# EAGLE schematic RBCX (EAGLE 9.6.2), part 2 of 3
## Sheet 4 of 8: User interface
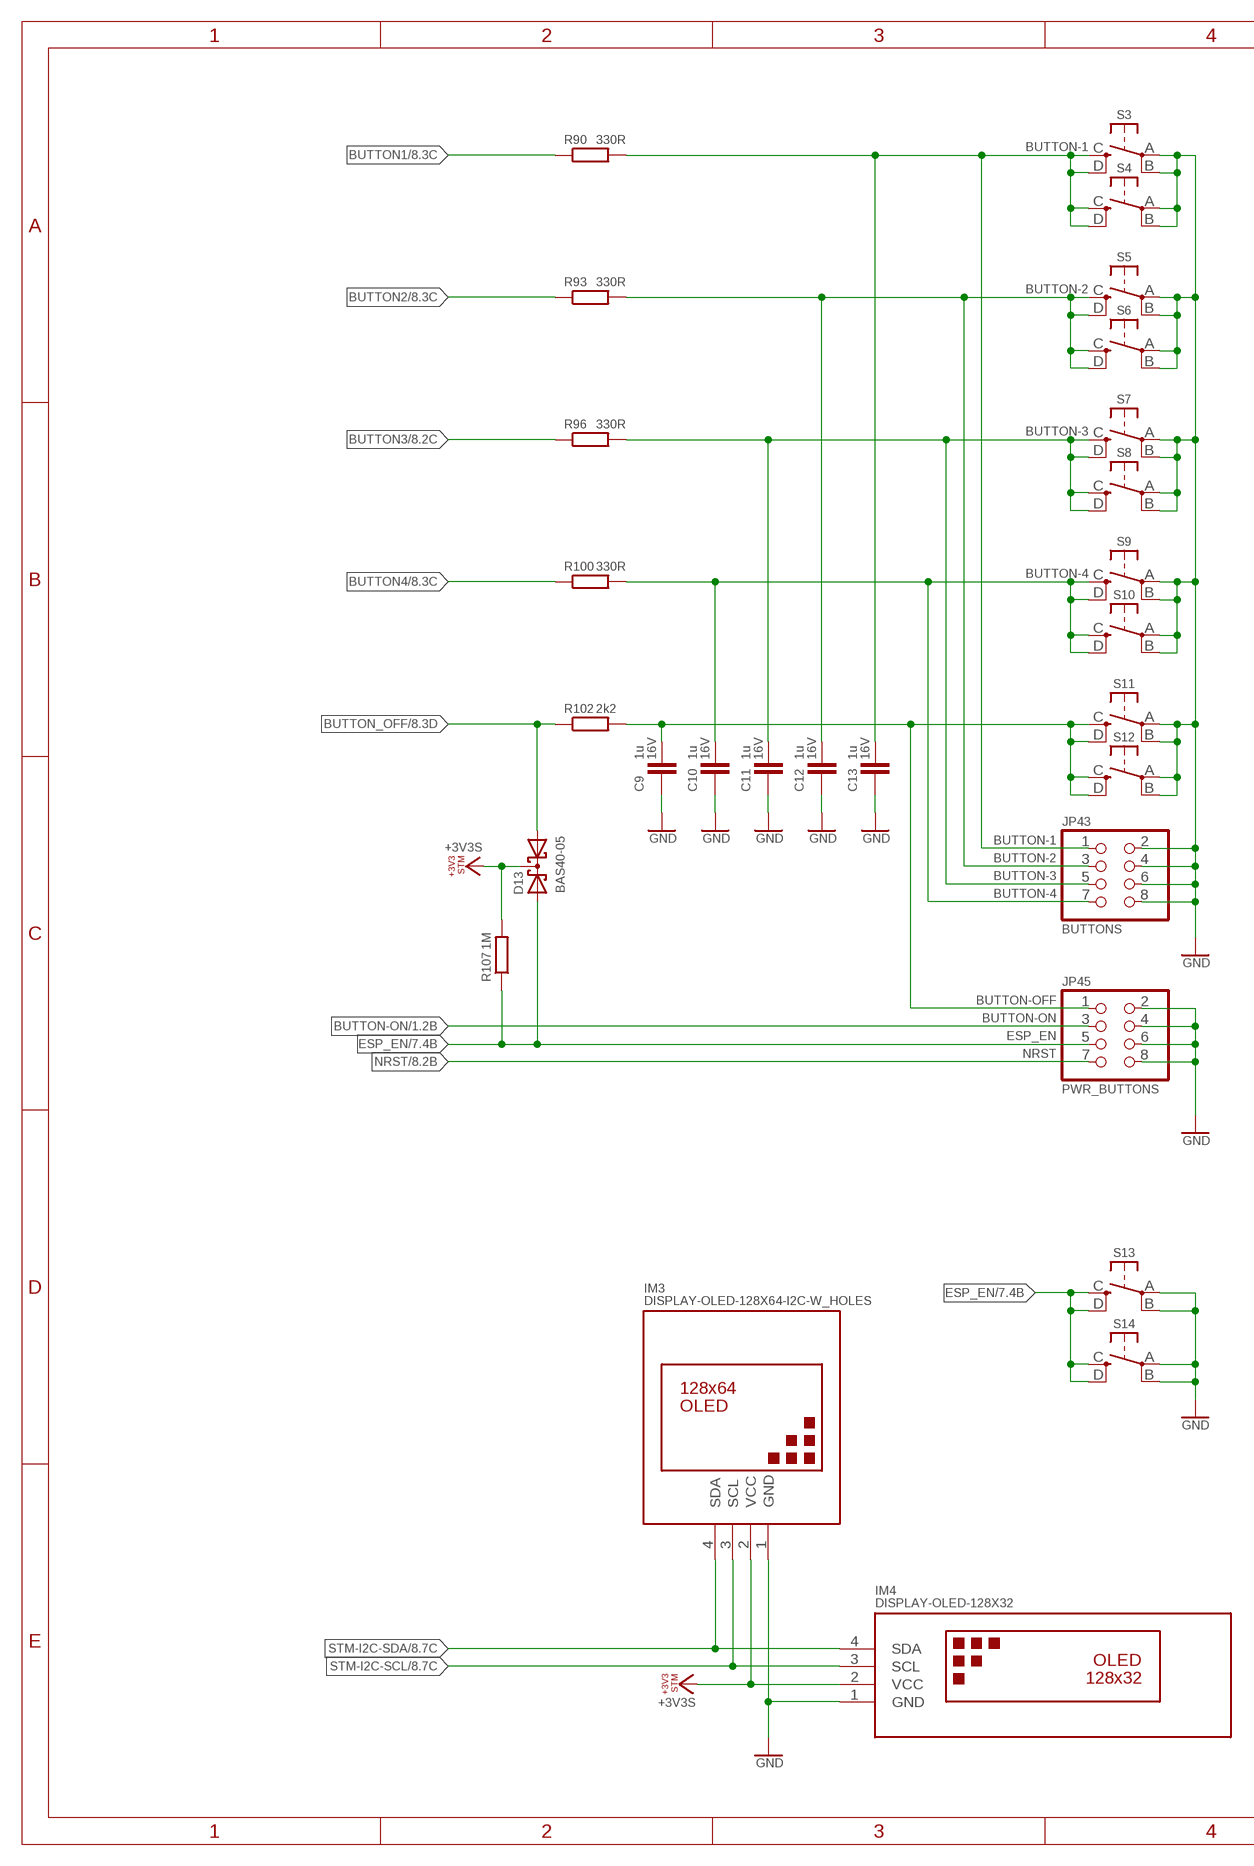
[diagram p6: schematic, sheet 4, part 1 of 2]
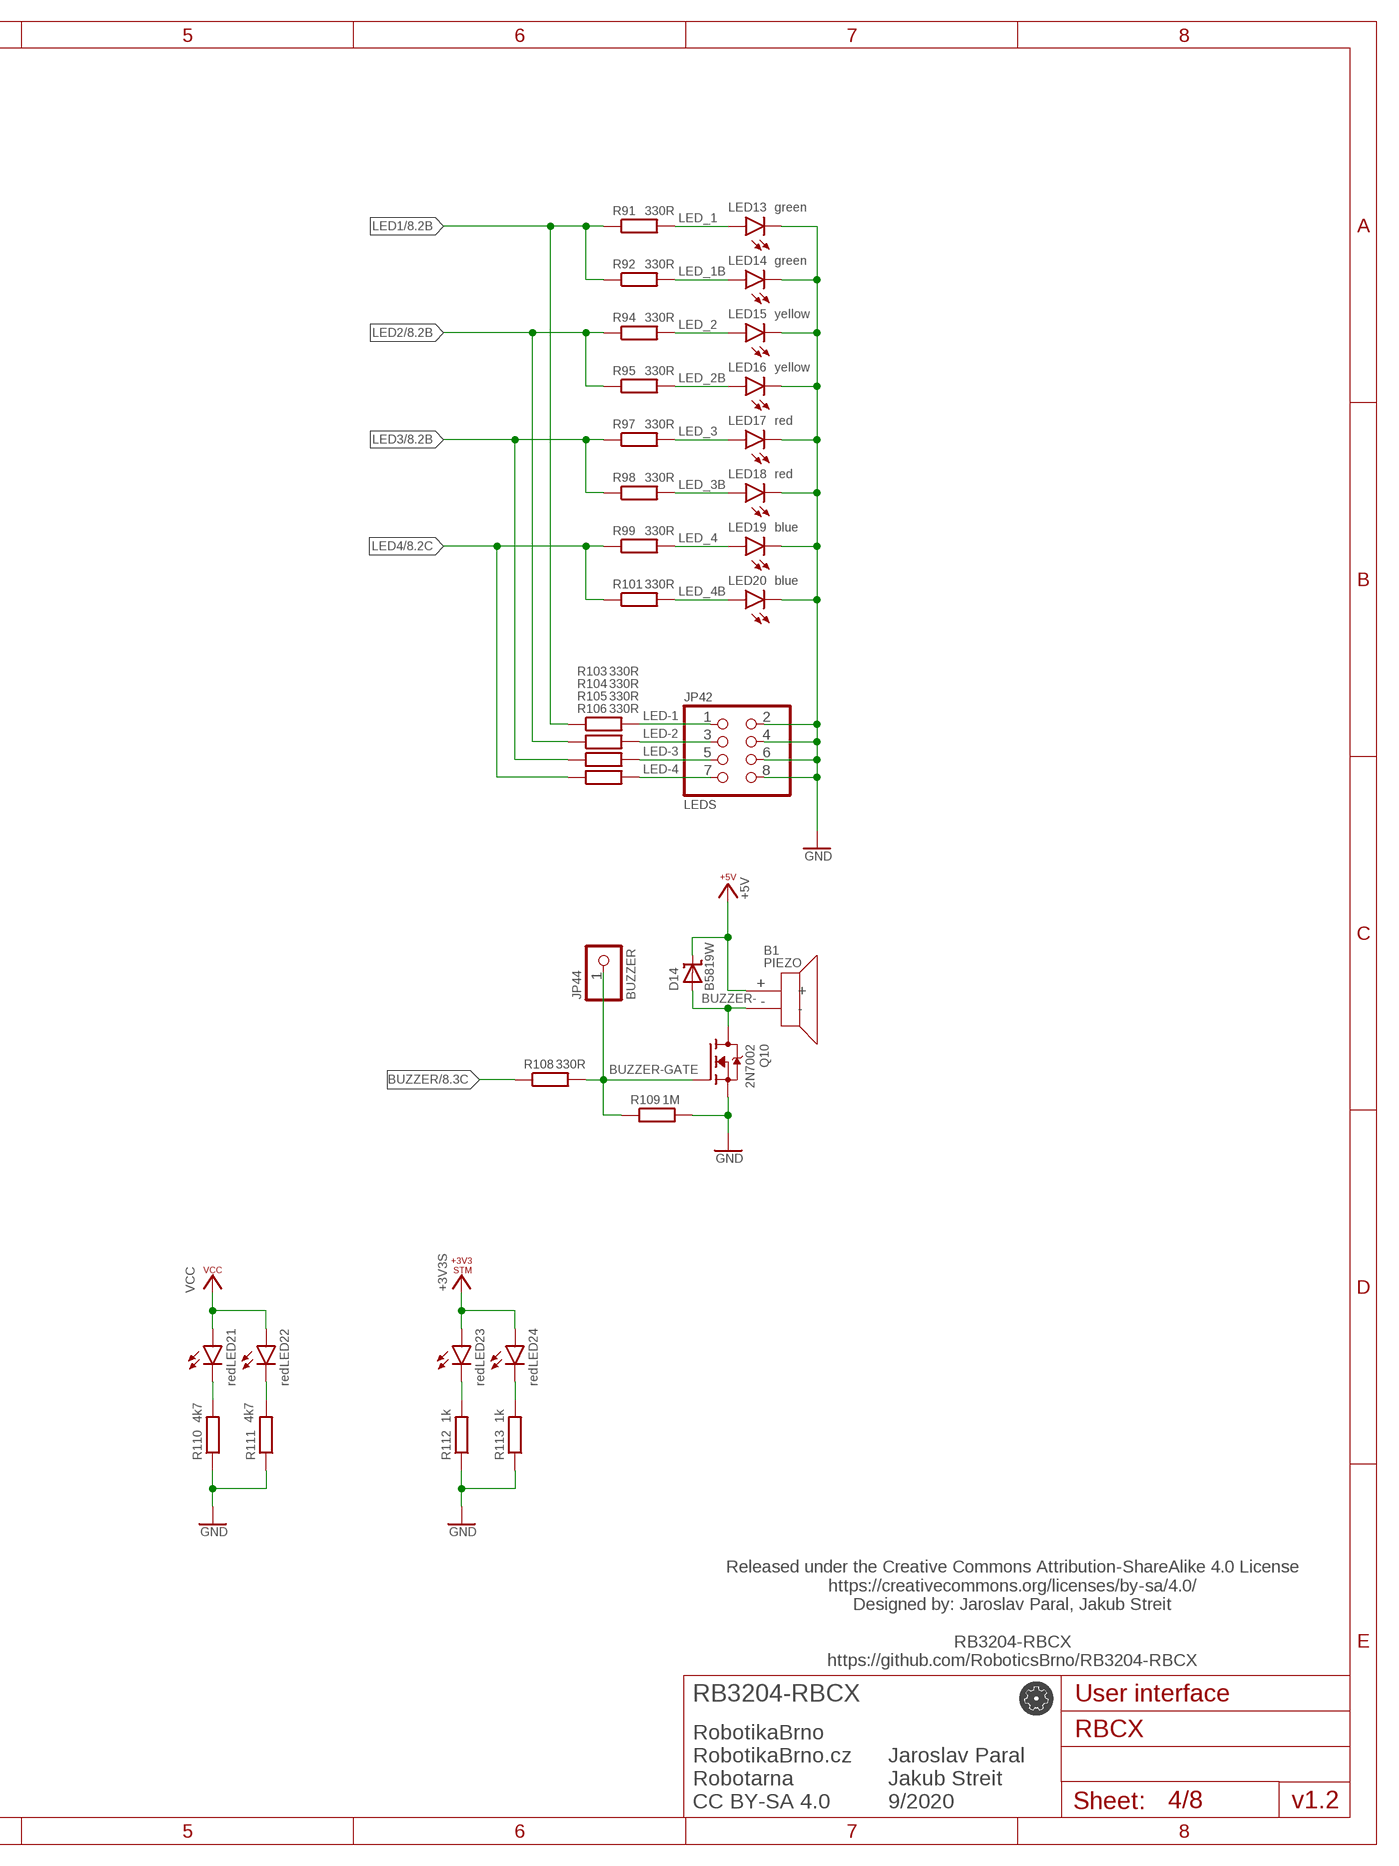
[diagram p7: schematic, sheet 4, part 2 of 2]

### Parts
B1  PIEZO  [PIEZO]  (not fitted in variant TOP_SMD_FULL)  (not fitted in variant TOP_SMD_WITHOUT_MPU)  (not fitted in variant TOP_SMD_WITHOUT_MOTOR_CURRENT)  (not fitted in variant TOP_SMD_WITHOUT_SERVO_CURRENT)  (not fitted in variant TOP_SMD_WITHOUT_CURRENT)  (not fitted in variant TOP_SMD_MINIMAL)
C9  1u  C-EUC0402  [C0402]
C10  1u  C-EUC0402  [C0402]
C11  1u  C-EUC0402  [C0402]
C12  1u  C-EUC0402  [C0402]
C13  1u  C-EUC0402  [C0402]
D13  BAS40-05  [SOT23]
D14  B5819W  SHOTTKY-SOD123  [SOD123]
IM3  DISPLAY-OLED-128X64-I2C-W_HOLES  [DISPLAY-OLED-128X64-I2C_W-HOLES]  (not fitted in variant TOP_SMD_FULL)  (not fitted in variant TOP_SMD_WITHOUT_MPU)  (not fitted in variant TOP_SMD_WITHOUT_MOTOR_CURRENT)  (not fitted in variant TOP_SMD_WITHOUT_SERVO_CURRENT)  (not fitted in variant TOP_SMD_WITHOUT_CURRENT)  (not fitted in variant TOP_SMD_MINIMAL)
IM4  DISPLAY-OLED-128X32  [DISPLAY-OLED-128X32]  (not fitted in variant TOP_SMD_FULL)  (not fitted in variant TOP_SMD_WITHOUT_MPU)  (not fitted in variant TOP_SMD_WITHOUT_MOTOR_CURRENT)  (not fitted in variant TOP_SMD_WITHOUT_SERVO_CURRENT)  (not fitted in variant TOP_SMD_WITHOUT_CURRENT)  (not fitted in variant TOP_SMD_MINIMAL)
JP42  LEDS  PINHD-2X4  [2X04]  (not fitted in variant TOP_SMD_FULL)  (not fitted in variant TOP_SMD_WITHOUT_MPU)  (not fitted in variant TOP_SMD_WITHOUT_MOTOR_CURRENT)  (not fitted in variant TOP_SMD_WITHOUT_SERVO_CURRENT)  (not fitted in variant TOP_SMD_WITHOUT_CURRENT)  (not fitted in variant TOP_SMD_MINIMAL)
JP43  BUTTONS  PINHD-2X4  [2X04]  (not fitted in variant TOP_SMD_FULL)  (not fitted in variant TOP_SMD_WITHOUT_MPU)  (not fitted in variant TOP_SMD_WITHOUT_MOTOR_CURRENT)  (not fitted in variant TOP_SMD_WITHOUT_SERVO_CURRENT)  (not fitted in variant TOP_SMD_WITHOUT_CURRENT)  (not fitted in variant TOP_SMD_MINIMAL)
JP44  BUZZER  PINHD-1X1  [1X01]  (not fitted in variant TOP_SMD_FULL)  (not fitted in variant TOP_SMD_WITHOUT_MPU)  (not fitted in variant TOP_SMD_WITHOUT_MOTOR_CURRENT)  (not fitted in variant TOP_SMD_WITHOUT_SERVO_CURRENT)  (not fitted in variant TOP_SMD_WITHOUT_CURRENT)  (not fitted in variant TOP_SMD_MINIMAL)
JP45  PWR_BUTTONS  PINHD-2X4  [2X04]  (not fitted in variant TOP_SMD_FULL)  (not fitted in variant TOP_SMD_WITHOUT_MPU)  (not fitted in variant TOP_SMD_WITHOUT_MOTOR_CURRENT)  (not fitted in variant TOP_SMD_WITHOUT_SERVO_CURRENT)  (not fitted in variant TOP_SMD_WITHOUT_CURRENT)  (not fitted in variant TOP_SMD_MINIMAL)
LED13  green  LEDCHIPLED_0603  [CHIPLED_0603]
LED14  green  LEDCHIPLED_0603  [CHIPLED_0603]  (not fitted in variant TOP_SMD_FULL)  (not fitted in variant TOP_SMD_WITHOUT_MPU)  (not fitted in variant TOP_SMD_WITHOUT_MOTOR_CURRENT)  (not fitted in variant TOP_SMD_WITHOUT_SERVO_CURRENT)  (not fitted in variant TOP_SMD_WITHOUT_CURRENT)  (not fitted in variant TOP_SMD_MINIMAL)
LED15  yellow  LEDCHIPLED_0603  [CHIPLED_0603]
LED16  yellow  LEDCHIPLED_0603  [CHIPLED_0603]  (not fitted in variant TOP_SMD_FULL)  (not fitted in variant TOP_SMD_WITHOUT_MPU)  (not fitted in variant TOP_SMD_WITHOUT_MOTOR_CURRENT)  (not fitted in variant TOP_SMD_WITHOUT_SERVO_CURRENT)  (not fitted in variant TOP_SMD_WITHOUT_CURRENT)  (not fitted in variant TOP_SMD_MINIMAL)
LED17  red  LEDCHIPLED_0603  [CHIPLED_0603]
LED18  red  LEDCHIPLED_0603  [CHIPLED_0603]  (not fitted in variant TOP_SMD_FULL)  (not fitted in variant TOP_SMD_WITHOUT_MPU)  (not fitted in variant TOP_SMD_WITHOUT_MOTOR_CURRENT)  (not fitted in variant TOP_SMD_WITHOUT_SERVO_CURRENT)  (not fitted in variant TOP_SMD_WITHOUT_CURRENT)  (not fitted in variant TOP_SMD_MINIMAL)
LED19  blue  LEDCHIPLED_0603  [CHIPLED_0603]
LED20  blue  LEDCHIPLED_0603  [CHIPLED_0603]  (not fitted in variant TOP_SMD_FULL)  (not fitted in variant TOP_SMD_WITHOUT_MPU)  (not fitted in variant TOP_SMD_WITHOUT_MOTOR_CURRENT)  (not fitted in variant TOP_SMD_WITHOUT_SERVO_CURRENT)  (not fitted in variant TOP_SMD_WITHOUT_CURRENT)  (not fitted in variant TOP_SMD_MINIMAL)
LED21  red  LEDCHIPLED_0603  [CHIPLED_0603]
LED22  red  LEDCHIPLED_0603  [CHIPLED_0603]  (not fitted in variant TOP_SMD_FULL)  (not fitted in variant TOP_SMD_WITHOUT_MPU)  (not fitted in variant TOP_SMD_WITHOUT_MOTOR_CURRENT)  (not fitted in variant TOP_SMD_WITHOUT_SERVO_CURRENT)  (not fitted in variant TOP_SMD_WITHOUT_CURRENT)  (not fitted in variant TOP_SMD_MINIMAL)
LED23  red  LEDCHIPLED_0603  [CHIPLED_0603]
LED24  red  LEDCHIPLED_0603  [CHIPLED_0603]  (not fitted in variant TOP_SMD_FULL)  (not fitted in variant TOP_SMD_WITHOUT_MPU)  (not fitted in variant TOP_SMD_WITHOUT_MOTOR_CURRENT)  (not fitted in variant TOP_SMD_WITHOUT_SERVO_CURRENT)  (not fitted in variant TOP_SMD_WITHOUT_CURRENT)  (not fitted in variant TOP_SMD_MINIMAL)
Q10  2N7002  N-MOSFET-SOT23-GSD  [SOT23]
R90  330R  R-EU_R0402  [R0402]
R91  330R  R-EU_R0402  [R0402]
R92  330R  R-EU_R0402  [R0402]  (not fitted in variant TOP_SMD_MINIMAL)
R93  330R  R-EU_R0402  [R0402]
R94  330R  R-EU_R0402  [R0402]
R95  330R  R-EU_R0402  [R0402]  (not fitted in variant TOP_SMD_MINIMAL)
R96  330R  R-EU_R0402  [R0402]
R97  330R  R-EU_R0402  [R0402]
R98  330R  R-EU_R0402  [R0402]  (not fitted in variant TOP_SMD_MINIMAL)
R99  330R  R-EU_R0402  [R0402]
R100  330R  R-EU_R0402  [R0402]
R101  330R  R-EU_R0402  [R0402]  (not fitted in variant TOP_SMD_MINIMAL)
R102  2k2  R-EU_R0402  [R0402]
R103  330R  R-EU_R0402  [R0402]
R104  330R  R-EU_R0402  [R0402]
R105  330R  R-EU_R0402  [R0402]
R106  330R  R-EU_R0402  [R0402]
R107  1M  R-EU_R0402  [R0402]
R108  330R  R-EU_R0402  [R0402]
R109  1M  R-EU_R0402  [R0402]
R110  4k7  R-EU_R0402  [R0402]
R111  4k7  R-EU_R0402  [R0402]  (not fitted in variant TOP_SMD_MINIMAL)
R112  1k  R-EU_R0402  [R0402]
R113  1k  R-EU_R0402  [R0402]  (not fitted in variant TOP_SMD_MINIMAL)
S3  TS-1187A-C-C-B  10-XX_SMD  [TS-1187A]
S4  TS-1187A-C-C-B  10-XX_SMD  [TS-1187A]  (not fitted in variant TOP_SMD_FULL)  (not fitted in variant TOP_SMD_WITHOUT_MPU)  (not fitted in variant TOP_SMD_WITHOUT_MOTOR_CURRENT)  (not fitted in variant TOP_SMD_WITHOUT_SERVO_CURRENT)  (not fitted in variant TOP_SMD_WITHOUT_CURRENT)  (not fitted in variant TOP_SMD_MINIMAL)
S5  TS-1187A-C-C-B  10-XX_SMD  [TS-1187A]
S6  TS-1187A-C-C-B  10-XX_SMD  [TS-1187A]  (not fitted in variant TOP_SMD_FULL)  (not fitted in variant TOP_SMD_WITHOUT_MPU)  (not fitted in variant TOP_SMD_WITHOUT_MOTOR_CURRENT)  (not fitted in variant TOP_SMD_WITHOUT_SERVO_CURRENT)  (not fitted in variant TOP_SMD_WITHOUT_CURRENT)  (not fitted in variant TOP_SMD_MINIMAL)
S7  TS-1187A-C-C-B  10-XX_SMD  [TS-1187A]
S8  TS-1187A-C-C-B  10-XX_SMD  [TS-1187A]  (not fitted in variant TOP_SMD_FULL)  (not fitted in variant TOP_SMD_WITHOUT_MPU)  (not fitted in variant TOP_SMD_WITHOUT_MOTOR_CURRENT)  (not fitted in variant TOP_SMD_WITHOUT_SERVO_CURRENT)  (not fitted in variant TOP_SMD_WITHOUT_CURRENT)  (not fitted in variant TOP_SMD_MINIMAL)
S9  TS-1187A-C-C-B  10-XX_SMD  [TS-1187A]
S10  TS-1187A-C-C-B  10-XX_SMD  [TS-1187A]  (not fitted in variant TOP_SMD_FULL)  (not fitted in variant TOP_SMD_WITHOUT_MPU)  (not fitted in variant TOP_SMD_WITHOUT_MOTOR_CURRENT)  (not fitted in variant TOP_SMD_WITHOUT_SERVO_CURRENT)  (not fitted in variant TOP_SMD_WITHOUT_CURRENT)  (not fitted in variant TOP_SMD_MINIMAL)
S11  TS-1187A-C-C-B  10-XX_SMD  [TS-1187A]
S12  TS-1187A-C-C-B  10-XX_SMD  [TS-1187A]  (not fitted in variant TOP_SMD_FULL)  (not fitted in variant TOP_SMD_WITHOUT_MPU)  (not fitted in variant TOP_SMD_WITHOUT_MOTOR_CURRENT)  (not fitted in variant TOP_SMD_WITHOUT_SERVO_CURRENT)  (not fitted in variant TOP_SMD_WITHOUT_CURRENT)  (not fitted in variant TOP_SMD_MINIMAL)
S13  TS-1187A-C-C-B  10-XX_SMD  [TS-1187A]
S14  TS-1187A-C-C-B  10-XX_SMD  [TS-1187A]  (not fitted in variant TOP_SMD_FULL)  (not fitted in variant TOP_SMD_WITHOUT_MPU)  (not fitted in variant TOP_SMD_WITHOUT_MOTOR_CURRENT)  (not fitted in variant TOP_SMD_WITHOUT_SERVO_CURRENT)  (not fitted in variant TOP_SMD_WITHOUT_CURRENT)  (not fitted in variant TOP_SMD_MINIMAL)

### Nets
+3V3S: D13.3(C) IM3.2(VCC) IM4.2(VCC) LED23.A LED24.A R107.2 ; also sheet 1,2,3,5,6,8
+5V: B1.+ D14.C ; also sheet 1,2,3,5,6,7
BUTTON1: R90.1 ; also sheet 8
BUTTON2: R93.1 ; also sheet 8
BUTTON3: R96.1 ; also sheet 8
BUTTON4: R100.1 ; also sheet 8
BUTTON-1: C13.1 JP43.1 R90.2 S3.C(S) S3.D(S1) S4.C(S) S4.D(S1) ; also sheet 3
BUTTON-2: C12.1 JP43.3 R93.2 S5.C(S) S5.D(S1) S6.C(S) S6.D(S1) ; also sheet 3
BUTTON-3: C11.1 JP43.5 R96.2 S7.C(S) S7.D(S1) S8.C(S) S8.D(S1) ; also sheet 3
BUTTON-4: C10.1 JP43.7 R100.2 S9.C(S) S9.D(S1) S10.C(S) S10.D(S1) ; also sheet 3
BUTTON-OFF: C9.1 JP45.1 R102.2 S11.C(S) S11.D(S1) S12.C(S) S12.D(S1) ; also sheet 3
BUTTON-ON: JP45.3 ; also sheet 1,3
BUTTON_OFF: D13.1(A1) R102.1 ; also sheet 8
BUZZER: R108.1 ; also sheet 8
BUZZER-: B1.- D14.A Q10.3(D)
BUZZER-GATE: JP44.1 Q10.1(G) R108.2 R109.1 ; also sheet 3
ESP_EN: D13.2(A2) JP45.5 R107.1 S13.C(S) S13.D(S1) S14.C(S) S14.D(S1) ; also sheet 2,3,7,8
GND: C9.2 C10.2 C11.2 C12.2 C13.2 IM3.1(GND) IM4.1(GND) JP42.2 JP42.4 JP42.6 JP42.8 JP43.2 JP43.4 JP43.6 JP43.8 JP45.2 JP45.4 JP45.6 JP45.8 LED13.C LED14.C LED15.C LED16.C LED17.C LED18.C LED19.C LED20.C Q10.2(S) R109.2 R110.1 R111.1 R112.1 R113.1 S3.A(P) S3.B(P1) S4.A(P) S4.B(P1) S5.A(P) S5.B(P1) S6.A(P) S6.B(P1) S7.A(P) S7.B(P1) S8.A(P) S8.B(P1) S9.A(P) S9.B(P1) S10.A(P) S10.B(P1) S11.A(P) S11.B(P1) S12.A(P) S12.B(P1) S13.A(P) S13.B(P1) S14.A(P) S14.B(P1) ; also sheet 1,2,3,5,6,7,8
LED1: R91.1 R92.1 R103.1 ; also sheet 8
LED2: R94.1 R95.1 R104.1 ; also sheet 8
LED3: R97.1 R98.1 R105.1 ; also sheet 8
LED4: R99.1 R101.1 R106.1 ; also sheet 8
LED-1: JP42.1 R103.2 ; also sheet 3
LED-2: JP42.3 R104.2 ; also sheet 3
LED-3: JP42.5 R105.2 ; also sheet 3
LED-4: JP42.7 R106.2 ; also sheet 3
LED_1: LED13.A R91.2
LED_1B: LED14.A R92.2
LED_2: LED15.A R94.2
LED_2B: LED16.A R95.2
LED_3: LED17.A R97.2
LED_3B: LED18.A R98.2
LED_4: LED19.A R99.2
LED_4B: LED20.A R101.2
NRST: JP45.7 ; also sheet 3,8
PWRLED_+3V3S1: LED23.C R112.2
PWRLED_+3V3S_B1: LED24.C R113.2
PWRLED_VCC1: LED21.C R110.2
PWRLED_VCC_B1: LED22.C R111.2
STM-I2C-SCL: IM3.3(SCL) IM4.3(SCL) ; also sheet 3,8
STM-I2C-SDA: IM3.4(SDA) IM4.4(SDA) ; also sheet 3,8
VCC: LED21.A LED22.A ; also sheet 1,2,3,5,6

### Notes on the sheet
- Released under the Creative Commons Attribution-ShareAlike 4.0 License
  https://creativecommons.org/licenses/by-sa/4.0/
  Designed by: Jaroslav Paral, Jakub Streit
  
  RB3204-RBCX
  https://github.com/RoboticsBrno/RB3204-RBCX
- RB3204-RBCX
- RobotikaBrno
  RobotikaBrno.cz
  Robotarna
  CC BY-SA 4.0
- Jaroslav Paral
  Jakub Streit
  9/2020
- v1.2

## Sheet 5 of 8: Motors
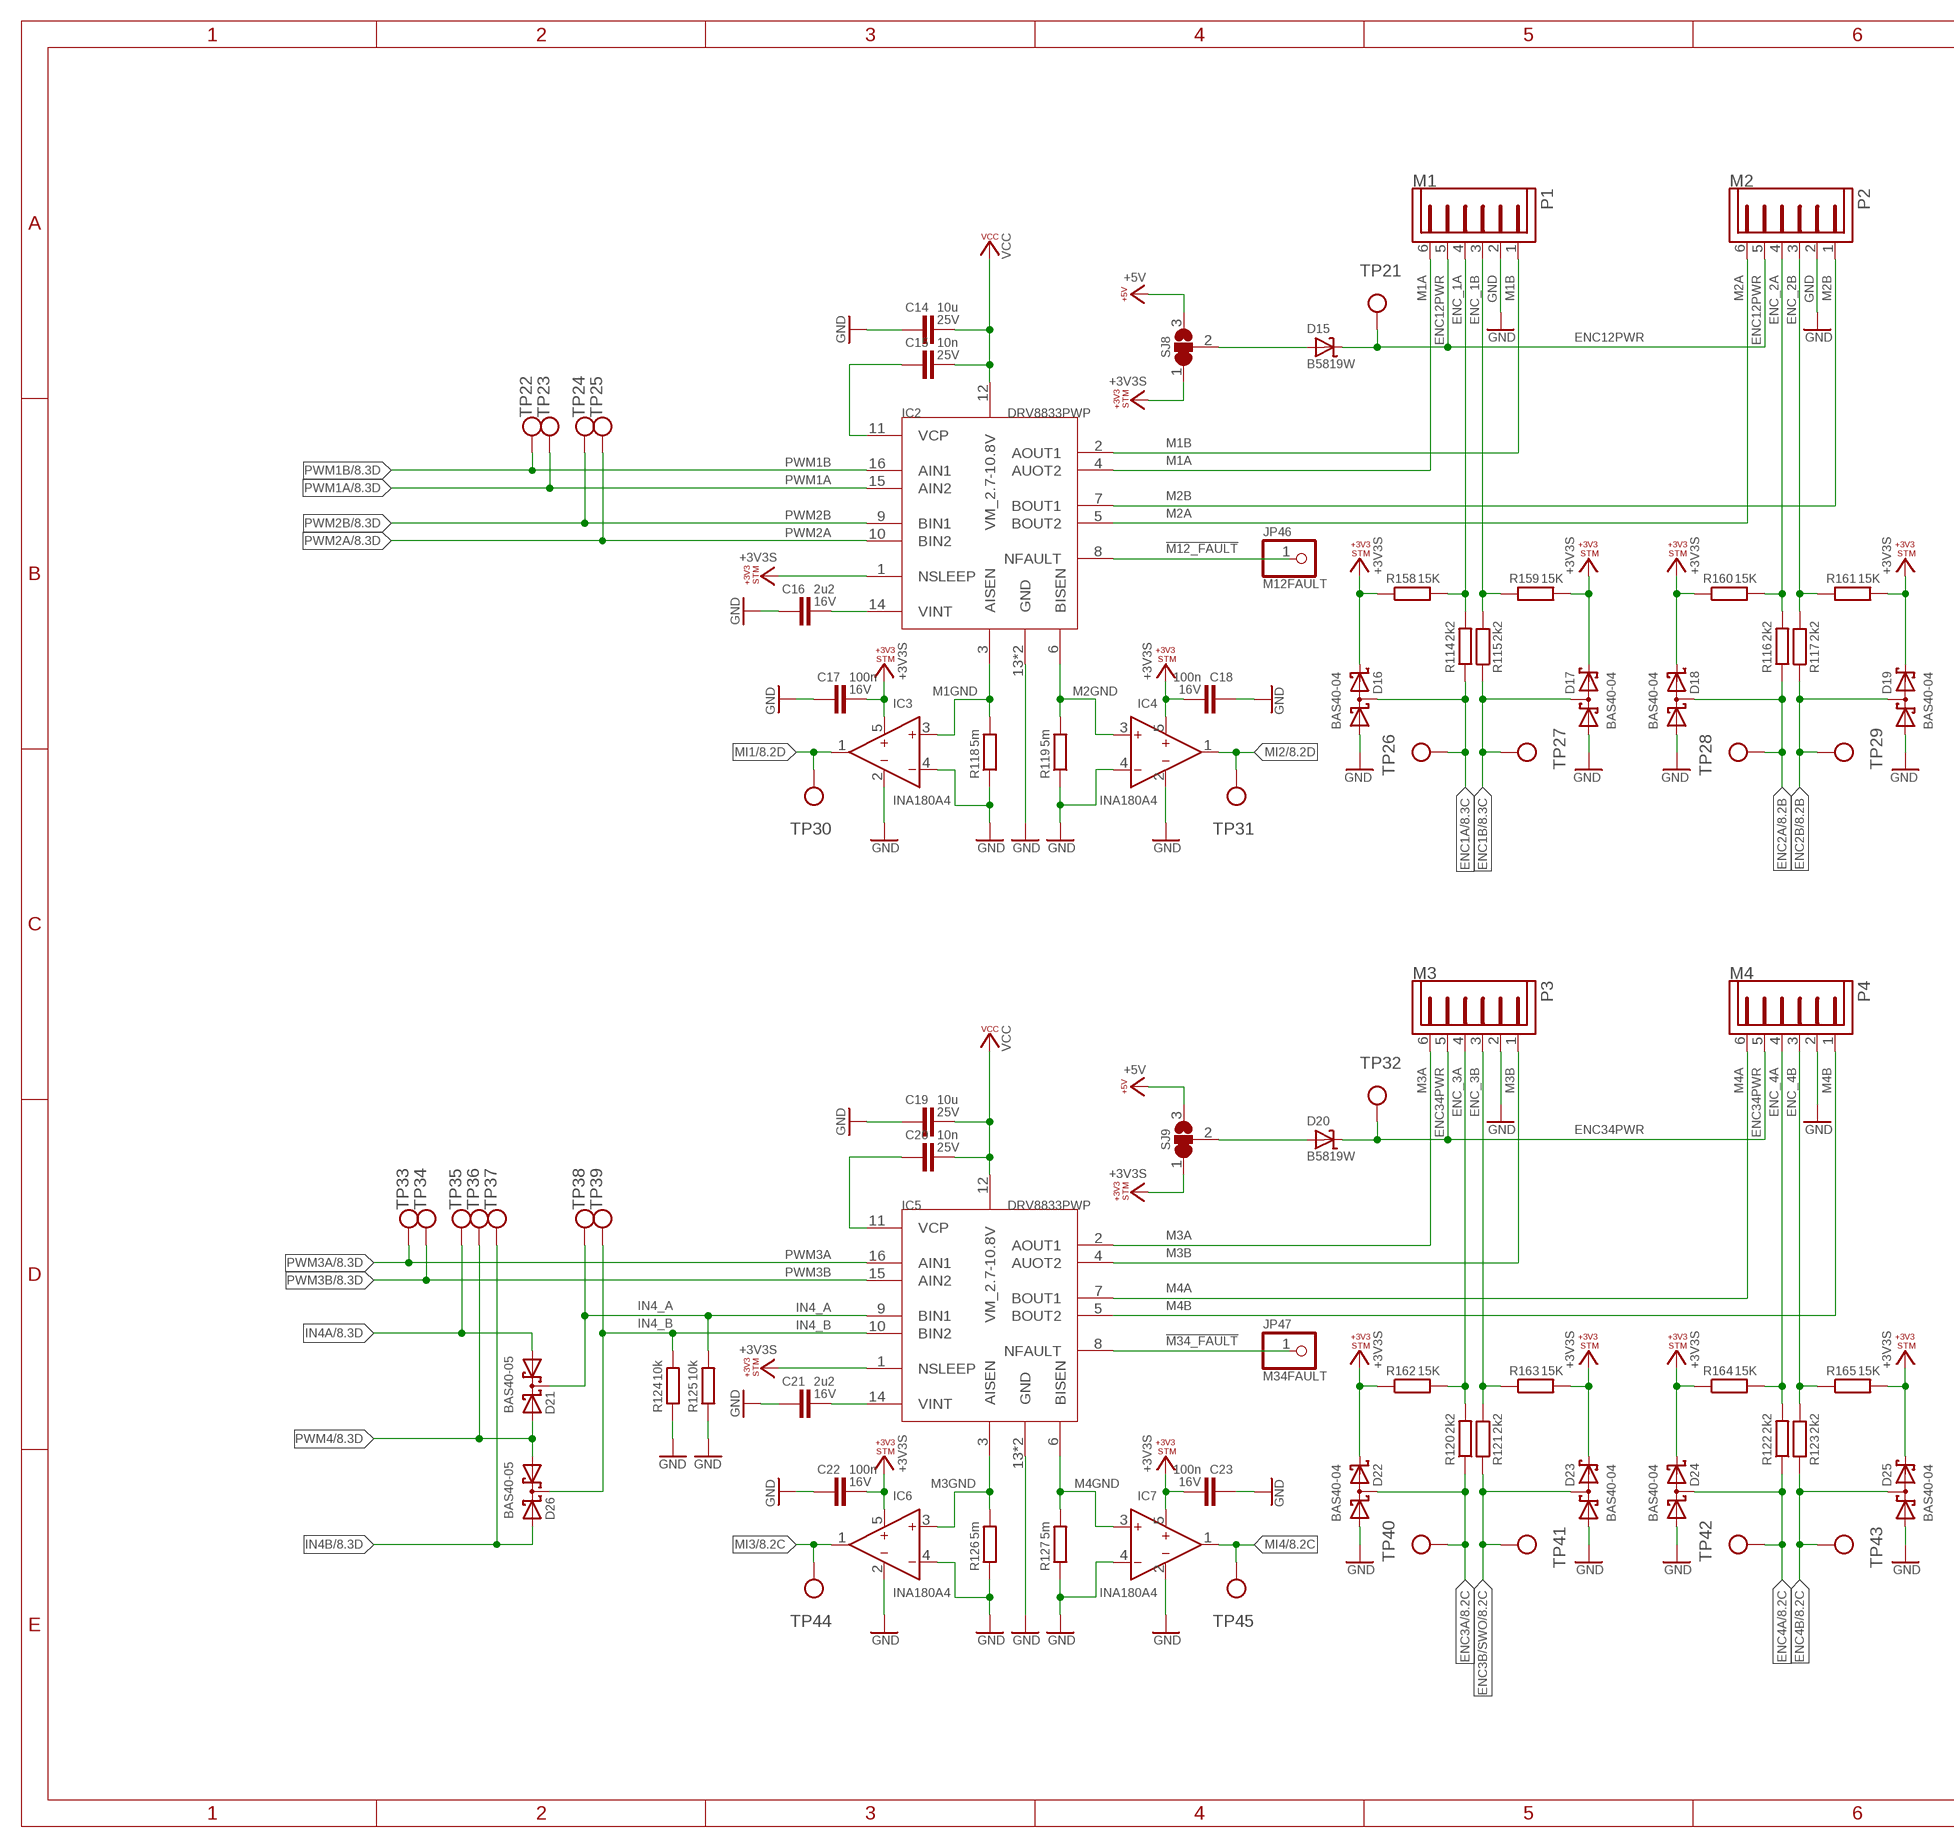
[diagram p8: schematic, sheet 5, part 1 of 2]
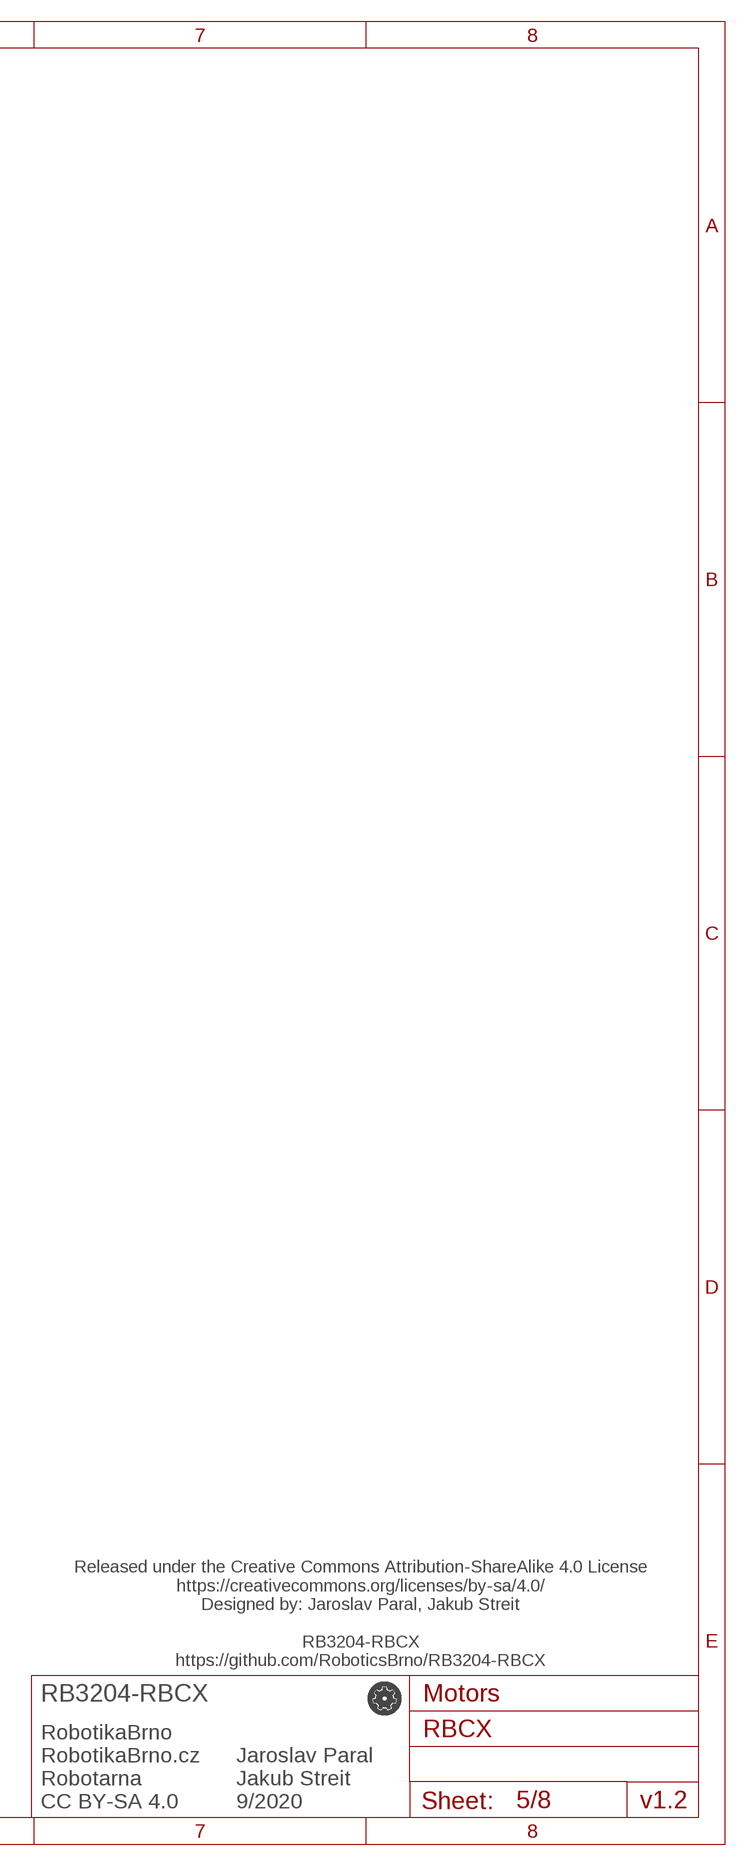
[diagram p9: schematic, sheet 5, part 2 of 2]

### Parts
C14  10u  C-EUC0805  [C0805]
C15  10n  C-EUC0402  [C0402]
C16  2u2  C-EUC0603  [C0603]
C17  100n  C-EUC0402  [C0402]  (not fitted in variant TOP_SMD_WITHOUT_MOTOR_CURRENT)  (not fitted in variant TOP_SMD_WITHOUT_CURRENT)  (not fitted in variant TOP_SMD_MINIMAL)
C18  100n  C-EUC0402  [C0402]  (not fitted in variant TOP_SMD_WITHOUT_MOTOR_CURRENT)  (not fitted in variant TOP_SMD_WITHOUT_CURRENT)  (not fitted in variant TOP_SMD_MINIMAL)
C19  10u  C-EUC0805  [C0805]
C20  10n  C-EUC0402  [C0402]
C21  2u2  C-EUC0603  [C0603]
C22  100n  C-EUC0402  [C0402]  (not fitted in variant TOP_SMD_WITHOUT_MOTOR_CURRENT)  (not fitted in variant TOP_SMD_WITHOUT_CURRENT)  (not fitted in variant TOP_SMD_MINIMAL)
C23  100n  C-EUC0402  [C0402]  (not fitted in variant TOP_SMD_WITHOUT_MOTOR_CURRENT)  (not fitted in variant TOP_SMD_WITHOUT_CURRENT)  (not fitted in variant TOP_SMD_MINIMAL)
D15  B5819W  SHOTTKY-SOD123  [SOD123]
D16  BAS40-04  [SOT23]
D17  BAS40-04  [SOT23]
D18  BAS40-04  [SOT23]
D19  BAS40-04  [SOT23]
D20  B5819W  SHOTTKY-SOD123  [SOD123]
D21  BAS40-05  [SOT23]
D22  BAS40-04  [SOT23]
D23  BAS40-04  [SOT23]
D24  BAS40-04  [SOT23]
D25  BAS40-04  [SOT23]
D26  BAS40-05  [SOT23]
IC2  DRV8833PWP  [HTSSOP]
IC3  INA180A4  INA180A  [SOT23-5L]  (not fitted in variant TOP_SMD_WITHOUT_MOTOR_CURRENT)  (not fitted in variant TOP_SMD_WITHOUT_CURRENT)  (not fitted in variant TOP_SMD_MINIMAL)
IC4  INA180A4  INA180A  [SOT23-5L]  (not fitted in variant TOP_SMD_WITHOUT_MOTOR_CURRENT)  (not fitted in variant TOP_SMD_WITHOUT_CURRENT)  (not fitted in variant TOP_SMD_MINIMAL)
IC5  DRV8833PWP  [HTSSOP]
IC6  INA180A4  INA180A  [SOT23-5L]  (not fitted in variant TOP_SMD_WITHOUT_MOTOR_CURRENT)  (not fitted in variant TOP_SMD_WITHOUT_CURRENT)  (not fitted in variant TOP_SMD_MINIMAL)
IC7  INA180A4  INA180A  [SOT23-5L]  (not fitted in variant TOP_SMD_WITHOUT_MOTOR_CURRENT)  (not fitted in variant TOP_SMD_WITHOUT_CURRENT)  (not fitted in variant TOP_SMD_MINIMAL)
JP46  M12FAULT  PINHD-1X1  [1X01]  (not fitted in variant TOP_SMD_FULL)  (not fitted in variant TOP_SMD_WITHOUT_MPU)  (not fitted in variant TOP_SMD_WITHOUT_MOTOR_CURRENT)  (not fitted in variant TOP_SMD_WITHOUT_SERVO_CURRENT)  (not fitted in variant TOP_SMD_WITHOUT_CURRENT)  (not fitted in variant TOP_SMD_MINIMAL)
JP47  M34FAULT  PINHD-1X1  [1X01]  (not fitted in variant TOP_SMD_FULL)  (not fitted in variant TOP_SMD_WITHOUT_MPU)  (not fitted in variant TOP_SMD_WITHOUT_MOTOR_CURRENT)  (not fitted in variant TOP_SMD_WITHOUT_SERVO_CURRENT)  (not fitted in variant TOP_SMD_WITHOUT_CURRENT)  (not fitted in variant TOP_SMD_MINIMAL)
P1  M1  JST-PH6  [JST-PH6]  (not fitted in variant TOP_SMD_FULL)  (not fitted in variant TOP_SMD_WITHOUT_MPU)  (not fitted in variant TOP_SMD_WITHOUT_MOTOR_CURRENT)  (not fitted in variant TOP_SMD_WITHOUT_SERVO_CURRENT)  (not fitted in variant TOP_SMD_WITHOUT_CURRENT)  (not fitted in variant TOP_SMD_MINIMAL)
P2  M2  JST-PH6  [JST-PH6]  (not fitted in variant TOP_SMD_FULL)  (not fitted in variant TOP_SMD_WITHOUT_MPU)  (not fitted in variant TOP_SMD_WITHOUT_MOTOR_CURRENT)  (not fitted in variant TOP_SMD_WITHOUT_SERVO_CURRENT)  (not fitted in variant TOP_SMD_WITHOUT_CURRENT)  (not fitted in variant TOP_SMD_MINIMAL)
P3  M3  JST-PH6  [JST-PH6]  (not fitted in variant TOP_SMD_FULL)  (not fitted in variant TOP_SMD_WITHOUT_MPU)  (not fitted in variant TOP_SMD_WITHOUT_MOTOR_CURRENT)  (not fitted in variant TOP_SMD_WITHOUT_SERVO_CURRENT)  (not fitted in variant TOP_SMD_WITHOUT_CURRENT)  (not fitted in variant TOP_SMD_MINIMAL)
P4  M4  JST-PH6  [JST-PH6]  (not fitted in variant TOP_SMD_FULL)  (not fitted in variant TOP_SMD_WITHOUT_MPU)  (not fitted in variant TOP_SMD_WITHOUT_MOTOR_CURRENT)  (not fitted in variant TOP_SMD_WITHOUT_SERVO_CURRENT)  (not fitted in variant TOP_SMD_WITHOUT_CURRENT)  (not fitted in variant TOP_SMD_MINIMAL)
R114  2k2  R-EU_R0402  [R0402]
R115  2k2  R-EU_R0402  [R0402]
R116  2k2  R-EU_R0402  [R0402]
R117  2k2  R-EU_R0402  [R0402]
R118  5m  R-EU_R1206  [R1206]  (variant TOP_SMD_WITHOUT_MOTOR_CURRENT: 0R)  (variant TOP_SMD_WITHOUT_CURRENT: 0R)  (variant TOP_SMD_MINIMAL: 0R)
R119  5m  R-EU_R1206  [R1206]  (variant TOP_SMD_WITHOUT_MOTOR_CURRENT: 0R)  (variant TOP_SMD_WITHOUT_CURRENT: 0R)  (variant TOP_SMD_MINIMAL: 0R)
R120  2k2  R-EU_R0402  [R0402]
R121  2k2  R-EU_R0402  [R0402]
R122  2k2  R-EU_R0402  [R0402]
R123  2k2  R-EU_R0402  [R0402]
R124  10k  R-EU_R0402  [R0402]
R125  10k  R-EU_R0402  [R0402]
R126  5m  R-EU_R1206  [R1206]  (variant TOP_SMD_WITHOUT_MOTOR_CURRENT: 0R)  (variant TOP_SMD_WITHOUT_CURRENT: 0R)  (variant TOP_SMD_MINIMAL: 0R)
R127  5m  R-EU_R1206  [R1206]  (variant TOP_SMD_WITHOUT_MOTOR_CURRENT: 0R)  (variant TOP_SMD_WITHOUT_CURRENT: 0R)  (variant TOP_SMD_MINIMAL: 0R)
R158  15K  R-EU_R0402  [R0402]  (not fitted in variant TOP_SMD_MINIMAL)
R159  15K  R-EU_R0402  [R0402]  (not fitted in variant TOP_SMD_MINIMAL)
R160  15K  R-EU_R0402  [R0402]  (not fitted in variant TOP_SMD_MINIMAL)
R161  15K  R-EU_R0402  [R0402]  (not fitted in variant TOP_SMD_MINIMAL)
R162  15K  R-EU_R0402  [R0402]  (not fitted in variant TOP_SMD_MINIMAL)
R163  15K  R-EU_R0402  [R0402]  (not fitted in variant TOP_SMD_MINIMAL)
R164  15K  R-EU_R0402  [R0402]  (not fitted in variant TOP_SMD_MINIMAL)
R165  15K  R-EU_R0402  [R0402]  (not fitted in variant TOP_SMD_MINIMAL)
SJ8  SJ2W_DEFAULT  [SJ_2_DEFAULT]
SJ9  SJ2W_DEFAULT  [SJ_2_DEFAULT]
TP21  TP_06MM  [TP_06]  (not fitted in variant TOP_SMD_FULL)  (not fitted in variant TOP_SMD_WITHOUT_MPU)  (not fitted in variant TOP_SMD_WITHOUT_MOTOR_CURRENT)  (not fitted in variant TOP_SMD_WITHOUT_SERVO_CURRENT)  (not fitted in variant TOP_SMD_WITHOUT_CURRENT)  (not fitted in variant TOP_SMD_MINIMAL)
TP22  TP_06MM  [TP_06]  (not fitted in variant TOP_SMD_FULL)  (not fitted in variant TOP_SMD_WITHOUT_MPU)  (not fitted in variant TOP_SMD_WITHOUT_MOTOR_CURRENT)  (not fitted in variant TOP_SMD_WITHOUT_SERVO_CURRENT)  (not fitted in variant TOP_SMD_WITHOUT_CURRENT)  (not fitted in variant TOP_SMD_MINIMAL)
TP23  TP_06MM  [TP_06]  (not fitted in variant TOP_SMD_FULL)  (not fitted in variant TOP_SMD_WITHOUT_MPU)  (not fitted in variant TOP_SMD_WITHOUT_MOTOR_CURRENT)  (not fitted in variant TOP_SMD_WITHOUT_SERVO_CURRENT)  (not fitted in variant TOP_SMD_WITHOUT_CURRENT)  (not fitted in variant TOP_SMD_MINIMAL)
TP24  TP_06MM  [TP_06]  (not fitted in variant TOP_SMD_FULL)  (not fitted in variant TOP_SMD_WITHOUT_MPU)  (not fitted in variant TOP_SMD_WITHOUT_MOTOR_CURRENT)  (not fitted in variant TOP_SMD_WITHOUT_SERVO_CURRENT)  (not fitted in variant TOP_SMD_WITHOUT_CURRENT)  (not fitted in variant TOP_SMD_MINIMAL)
TP25  TP_06MM  [TP_06]  (not fitted in variant TOP_SMD_FULL)  (not fitted in variant TOP_SMD_WITHOUT_MPU)  (not fitted in variant TOP_SMD_WITHOUT_MOTOR_CURRENT)  (not fitted in variant TOP_SMD_WITHOUT_SERVO_CURRENT)  (not fitted in variant TOP_SMD_WITHOUT_CURRENT)  (not fitted in variant TOP_SMD_MINIMAL)
TP26  TP_06MM  [TP_06]  (not fitted in variant TOP_SMD_FULL)  (not fitted in variant TOP_SMD_WITHOUT_MPU)  (not fitted in variant TOP_SMD_WITHOUT_MOTOR_CURRENT)  (not fitted in variant TOP_SMD_WITHOUT_SERVO_CURRENT)  (not fitted in variant TOP_SMD_WITHOUT_CURRENT)  (not fitted in variant TOP_SMD_MINIMAL)
TP27  TP_06MM  [TP_06]  (not fitted in variant TOP_SMD_FULL)  (not fitted in variant TOP_SMD_WITHOUT_MPU)  (not fitted in variant TOP_SMD_WITHOUT_MOTOR_CURRENT)  (not fitted in variant TOP_SMD_WITHOUT_SERVO_CURRENT)  (not fitted in variant TOP_SMD_WITHOUT_CURRENT)  (not fitted in variant TOP_SMD_MINIMAL)
TP28  TP_06MM  [TP_06]  (not fitted in variant TOP_SMD_FULL)  (not fitted in variant TOP_SMD_WITHOUT_MPU)  (not fitted in variant TOP_SMD_WITHOUT_MOTOR_CURRENT)  (not fitted in variant TOP_SMD_WITHOUT_SERVO_CURRENT)  (not fitted in variant TOP_SMD_WITHOUT_CURRENT)  (not fitted in variant TOP_SMD_MINIMAL)
TP29  TP_06MM  [TP_06]  (not fitted in variant TOP_SMD_FULL)  (not fitted in variant TOP_SMD_WITHOUT_MPU)  (not fitted in variant TOP_SMD_WITHOUT_MOTOR_CURRENT)  (not fitted in variant TOP_SMD_WITHOUT_SERVO_CURRENT)  (not fitted in variant TOP_SMD_WITHOUT_CURRENT)  (not fitted in variant TOP_SMD_MINIMAL)
TP30  TP_06MM  [TP_06]  (not fitted in variant TOP_SMD_FULL)  (not fitted in variant TOP_SMD_WITHOUT_MPU)  (not fitted in variant TOP_SMD_WITHOUT_MOTOR_CURRENT)  (not fitted in variant TOP_SMD_WITHOUT_SERVO_CURRENT)  (not fitted in variant TOP_SMD_WITHOUT_CURRENT)  (not fitted in variant TOP_SMD_MINIMAL)
TP31  TP_06MM  [TP_06]  (not fitted in variant TOP_SMD_FULL)  (not fitted in variant TOP_SMD_WITHOUT_MPU)  (not fitted in variant TOP_SMD_WITHOUT_MOTOR_CURRENT)  (not fitted in variant TOP_SMD_WITHOUT_SERVO_CURRENT)  (not fitted in variant TOP_SMD_WITHOUT_CURRENT)  (not fitted in variant TOP_SMD_MINIMAL)
TP32  TP_06MM  [TP_06]  (not fitted in variant TOP_SMD_FULL)  (not fitted in variant TOP_SMD_WITHOUT_MPU)  (not fitted in variant TOP_SMD_WITHOUT_MOTOR_CURRENT)  (not fitted in variant TOP_SMD_WITHOUT_SERVO_CURRENT)  (not fitted in variant TOP_SMD_WITHOUT_CURRENT)  (not fitted in variant TOP_SMD_MINIMAL)
TP33  TP_06MM  [TP_06]  (not fitted in variant TOP_SMD_FULL)  (not fitted in variant TOP_SMD_WITHOUT_MPU)  (not fitted in variant TOP_SMD_WITHOUT_MOTOR_CURRENT)  (not fitted in variant TOP_SMD_WITHOUT_SERVO_CURRENT)  (not fitted in variant TOP_SMD_WITHOUT_CURRENT)  (not fitted in variant TOP_SMD_MINIMAL)
TP34  TP_06MM  [TP_06]  (not fitted in variant TOP_SMD_FULL)  (not fitted in variant TOP_SMD_WITHOUT_MPU)  (not fitted in variant TOP_SMD_WITHOUT_MOTOR_CURRENT)  (not fitted in variant TOP_SMD_WITHOUT_SERVO_CURRENT)  (not fitted in variant TOP_SMD_WITHOUT_CURRENT)  (not fitted in variant TOP_SMD_MINIMAL)
TP35  TP_06MM  [TP_06]  (not fitted in variant TOP_SMD_FULL)  (not fitted in variant TOP_SMD_WITHOUT_MPU)  (not fitted in variant TOP_SMD_WITHOUT_MOTOR_CURRENT)  (not fitted in variant TOP_SMD_WITHOUT_SERVO_CURRENT)  (not fitted in variant TOP_SMD_WITHOUT_CURRENT)  (not fitted in variant TOP_SMD_MINIMAL)
TP36  TP_06MM  [TP_06]  (not fitted in variant TOP_SMD_FULL)  (not fitted in variant TOP_SMD_WITHOUT_MPU)  (not fitted in variant TOP_SMD_WITHOUT_MOTOR_CURRENT)  (not fitted in variant TOP_SMD_WITHOUT_SERVO_CURRENT)  (not fitted in variant TOP_SMD_WITHOUT_CURRENT)  (not fitted in variant TOP_SMD_MINIMAL)
TP37  TP_06MM  [TP_06]  (not fitted in variant TOP_SMD_FULL)  (not fitted in variant TOP_SMD_WITHOUT_MPU)  (not fitted in variant TOP_SMD_WITHOUT_MOTOR_CURRENT)  (not fitted in variant TOP_SMD_WITHOUT_SERVO_CURRENT)  (not fitted in variant TOP_SMD_WITHOUT_CURRENT)  (not fitted in variant TOP_SMD_MINIMAL)
TP38  TP_06MM  [TP_06]  (not fitted in variant TOP_SMD_FULL)  (not fitted in variant TOP_SMD_WITHOUT_MPU)  (not fitted in variant TOP_SMD_WITHOUT_MOTOR_CURRENT)  (not fitted in variant TOP_SMD_WITHOUT_SERVO_CURRENT)  (not fitted in variant TOP_SMD_WITHOUT_CURRENT)  (not fitted in variant TOP_SMD_MINIMAL)
TP39  TP_06MM  [TP_06]  (not fitted in variant TOP_SMD_FULL)  (not fitted in variant TOP_SMD_WITHOUT_MPU)  (not fitted in variant TOP_SMD_WITHOUT_MOTOR_CURRENT)  (not fitted in variant TOP_SMD_WITHOUT_SERVO_CURRENT)  (not fitted in variant TOP_SMD_WITHOUT_CURRENT)  (not fitted in variant TOP_SMD_MINIMAL)
TP40  TP_06MM  [TP_06]  (not fitted in variant TOP_SMD_FULL)  (not fitted in variant TOP_SMD_WITHOUT_MPU)  (not fitted in variant TOP_SMD_WITHOUT_MOTOR_CURRENT)  (not fitted in variant TOP_SMD_WITHOUT_SERVO_CURRENT)  (not fitted in variant TOP_SMD_WITHOUT_CURRENT)  (not fitted in variant TOP_SMD_MINIMAL)
TP41  TP_06MM  [TP_06]  (not fitted in variant TOP_SMD_FULL)  (not fitted in variant TOP_SMD_WITHOUT_MPU)  (not fitted in variant TOP_SMD_WITHOUT_MOTOR_CURRENT)  (not fitted in variant TOP_SMD_WITHOUT_SERVO_CURRENT)  (not fitted in variant TOP_SMD_WITHOUT_CURRENT)  (not fitted in variant TOP_SMD_MINIMAL)
TP42  TP_06MM  [TP_06]  (not fitted in variant TOP_SMD_FULL)  (not fitted in variant TOP_SMD_WITHOUT_MPU)  (not fitted in variant TOP_SMD_WITHOUT_MOTOR_CURRENT)  (not fitted in variant TOP_SMD_WITHOUT_SERVO_CURRENT)  (not fitted in variant TOP_SMD_WITHOUT_CURRENT)  (not fitted in variant TOP_SMD_MINIMAL)
TP43  TP_06MM  [TP_06]  (not fitted in variant TOP_SMD_FULL)  (not fitted in variant TOP_SMD_WITHOUT_MPU)  (not fitted in variant TOP_SMD_WITHOUT_MOTOR_CURRENT)  (not fitted in variant TOP_SMD_WITHOUT_SERVO_CURRENT)  (not fitted in variant TOP_SMD_WITHOUT_CURRENT)  (not fitted in variant TOP_SMD_MINIMAL)
TP44  TP_06MM  [TP_06]  (not fitted in variant TOP_SMD_FULL)  (not fitted in variant TOP_SMD_WITHOUT_MPU)  (not fitted in variant TOP_SMD_WITHOUT_MOTOR_CURRENT)  (not fitted in variant TOP_SMD_WITHOUT_SERVO_CURRENT)  (not fitted in variant TOP_SMD_WITHOUT_CURRENT)  (not fitted in variant TOP_SMD_MINIMAL)
TP45  TP_06MM  [TP_06]  (not fitted in variant TOP_SMD_FULL)  (not fitted in variant TOP_SMD_WITHOUT_MPU)  (not fitted in variant TOP_SMD_WITHOUT_MOTOR_CURRENT)  (not fitted in variant TOP_SMD_WITHOUT_SERVO_CURRENT)  (not fitted in variant TOP_SMD_WITHOUT_CURRENT)  (not fitted in variant TOP_SMD_MINIMAL)

### Nets
!M12_FAULT: IC2.8(NFAULT) JP46.1
!M34_FAULT: IC5.8(NFAULT) JP47.1
+3V3S: C17.1 C18.1 C22.1 C23.1 D16.2(C2) D17.2(C2) D18.2(C2) D19.2(C2) D22.2(C2) D23.2(C2) D24.2(C2) D25.2(C2) IC2.1(NSLEEP) IC3.5(VCC) IC4.5(VCC) IC5.1(NSLEEP) IC6.5(VCC) IC7.5(VCC) R158.1 R159.2 R160.1 R161.2 R162.1 R163.2 R164.1 R165.2 SJ8.1 SJ9.1 ; also sheet 1,2,3,4,6,8
+5V: SJ8.3 SJ9.3 ; also sheet 1,2,3,4,6,7
ENC1A: D16.3(C1A2) R114.1 TP26.P$1(TP) ; also sheet 8
ENC1B: D17.3(C1A2) R115.1 TP27.P$1(TP) ; also sheet 8
ENC2A: D18.3(C1A2) R116.1 TP28.P$1(TP) ; also sheet 8
ENC2B: D19.3(C1A2) R117.1 TP29.P$1(TP) ; also sheet 8
ENC3A: D22.3(C1A2) R120.1 TP40.P$1(TP) ; also sheet 8
ENC3B/SWO: D23.3(C1A2) R121.1 TP41.P$1(TP) ; also sheet 3,8
ENC4A: D24.3(C1A2) R122.1 TP42.P$1(TP) ; also sheet 8
ENC4B: D25.3(C1A2) R123.1 TP43.P$1(TP) ; also sheet 8
ENC12_PWR: D15.A SJ8.2
ENC12PWR: D15.C P1.5 P2.5 TP21.P$1(TP)
ENC34_PWR: D20.A SJ9.2
ENC34PWR: D20.C P3.5 P4.5 TP32.P$1(TP)
ENC_1A: P1.4 R114.2 R158.2
ENC_1B: P1.3 R115.2 R159.1
ENC_2A: P2.4 R116.2 R160.2
ENC_2B: P2.3 R117.2 R161.1
ENC_3A: P3.4 R120.2 R162.2
ENC_3B: P3.3 R121.2 R163.1
ENC_4A: P4.4 R122.2 R164.2
ENC_4B: P4.3 R123.2 R165.1
GND: C14.2 C16.2 C17.2 C18.2 C19.2 C21.2 C22.2 C23.2 D16.1(A1) D17.1(A1) D18.1(A1) D19.1(A1) D22.1(A1) D23.1(A1) D24.1(A1) D25.1(A1) IC2.13(GND) IC2.GND IC3.2(GND) IC3.4(IN-) IC4.2(GND) IC4.4(IN-) IC5.13(GND) IC5.GND IC6.2(GND) IC6.4(IN-) IC7.2(GND) IC7.4(IN-) P1.2 P2.2 P3.2 P4.2 R118.1 R119.1 R124.1 R125.1 R126.1 R127.1 ; also sheet 1,2,3,4,6,7,8
IN4_A: D21.3(C) IC5.9(BIN1) R125.2 TP38.P$1(TP)
IN4_B: D26.3(C) IC5.10(BIN2) R124.2 TP39.P$1(TP)
IN4A: D21.1(A1) TP35.P$1(TP) ; also sheet 8
IN4B: D26.2(A2) TP37.P$1(TP) ; also sheet 8
M1A: IC2.4(AUOT2) P1.6
M1B: IC2.2(AOUT1) P1.1
M1GND: IC2.3(AISEN) IC3.3(IN+) R118.2
M2A: IC2.5(BOUT2) P2.6
M2B: IC2.7(BOUT1) P2.1
M2GND: IC2.6(BISEN) IC4.3(IN+) R119.2
M3A: IC5.2(AOUT1) P3.6
M3B: IC5.4(AUOT2) P3.1
M3GND: IC5.3(AISEN) IC6.3(IN+) R126.2
M4A: IC5.7(BOUT1) P4.6
M4B: IC5.5(BOUT2) P4.1
M4GND: IC5.6(BISEN) IC7.3(IN+) R127.2
MI1: IC3.1(OUT) TP30.P$1(TP) ; also sheet 8
MI2: IC4.1(OUT) TP31.P$1(TP) ; also sheet 8
MI3: IC6.1(OUT) TP44.P$1(TP) ; also sheet 8
MI4: IC7.1(OUT) TP45.P$1(TP) ; also sheet 8
PWM1A: IC2.15(AIN2) TP23.P$1(TP) ; also sheet 8
PWM1B: IC2.16(AIN1) TP22.P$1(TP) ; also sheet 8
PWM2A: IC2.10(BIN2) TP25.P$1(TP) ; also sheet 8
PWM2B: IC2.9(BIN1) TP24.P$1(TP) ; also sheet 8
PWM3A: IC5.16(AIN1) TP33.P$1(TP) ; also sheet 8
PWM3B: IC5.15(AIN2) TP34.P$1(TP) ; also sheet 8
PWM4: D21.2(A2) D26.1(A1) TP36.P$1(TP) ; also sheet 8
VCC: C14.1 C15.1 C19.1 C20.1 IC2.12(VM_2.7-10.8V) IC5.12(VM_2.7-10.8V) ; also sheet 1,2,3,4,6
VCP12: C15.2 IC2.11(VCP)
VCP34: C20.2 IC5.11(VCP)
VINT12: C16.1 IC2.14(VINT)
VINT34: C21.1 IC5.14(VINT)

### Notes on the sheet
- Released under the Creative Commons Attribution-ShareAlike 4.0 License
  https://creativecommons.org/licenses/by-sa/4.0/
  Designed by: Jaroslav Paral, Jakub Streit
  
  RB3204-RBCX
  https://github.com/RoboticsBrno/RB3204-RBCX
- RB3204-RBCX
- RobotikaBrno
  RobotikaBrno.cz
  Robotarna
  CC BY-SA 4.0
- Jaroslav Paral
  Jakub Streit
  9/2020
- v1.2

## Sheet 6 of 8: Servos
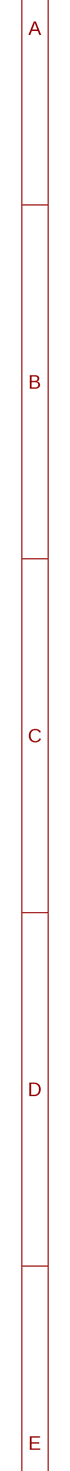
[diagram p10: schematic, sheet 6, part 1 of 2]
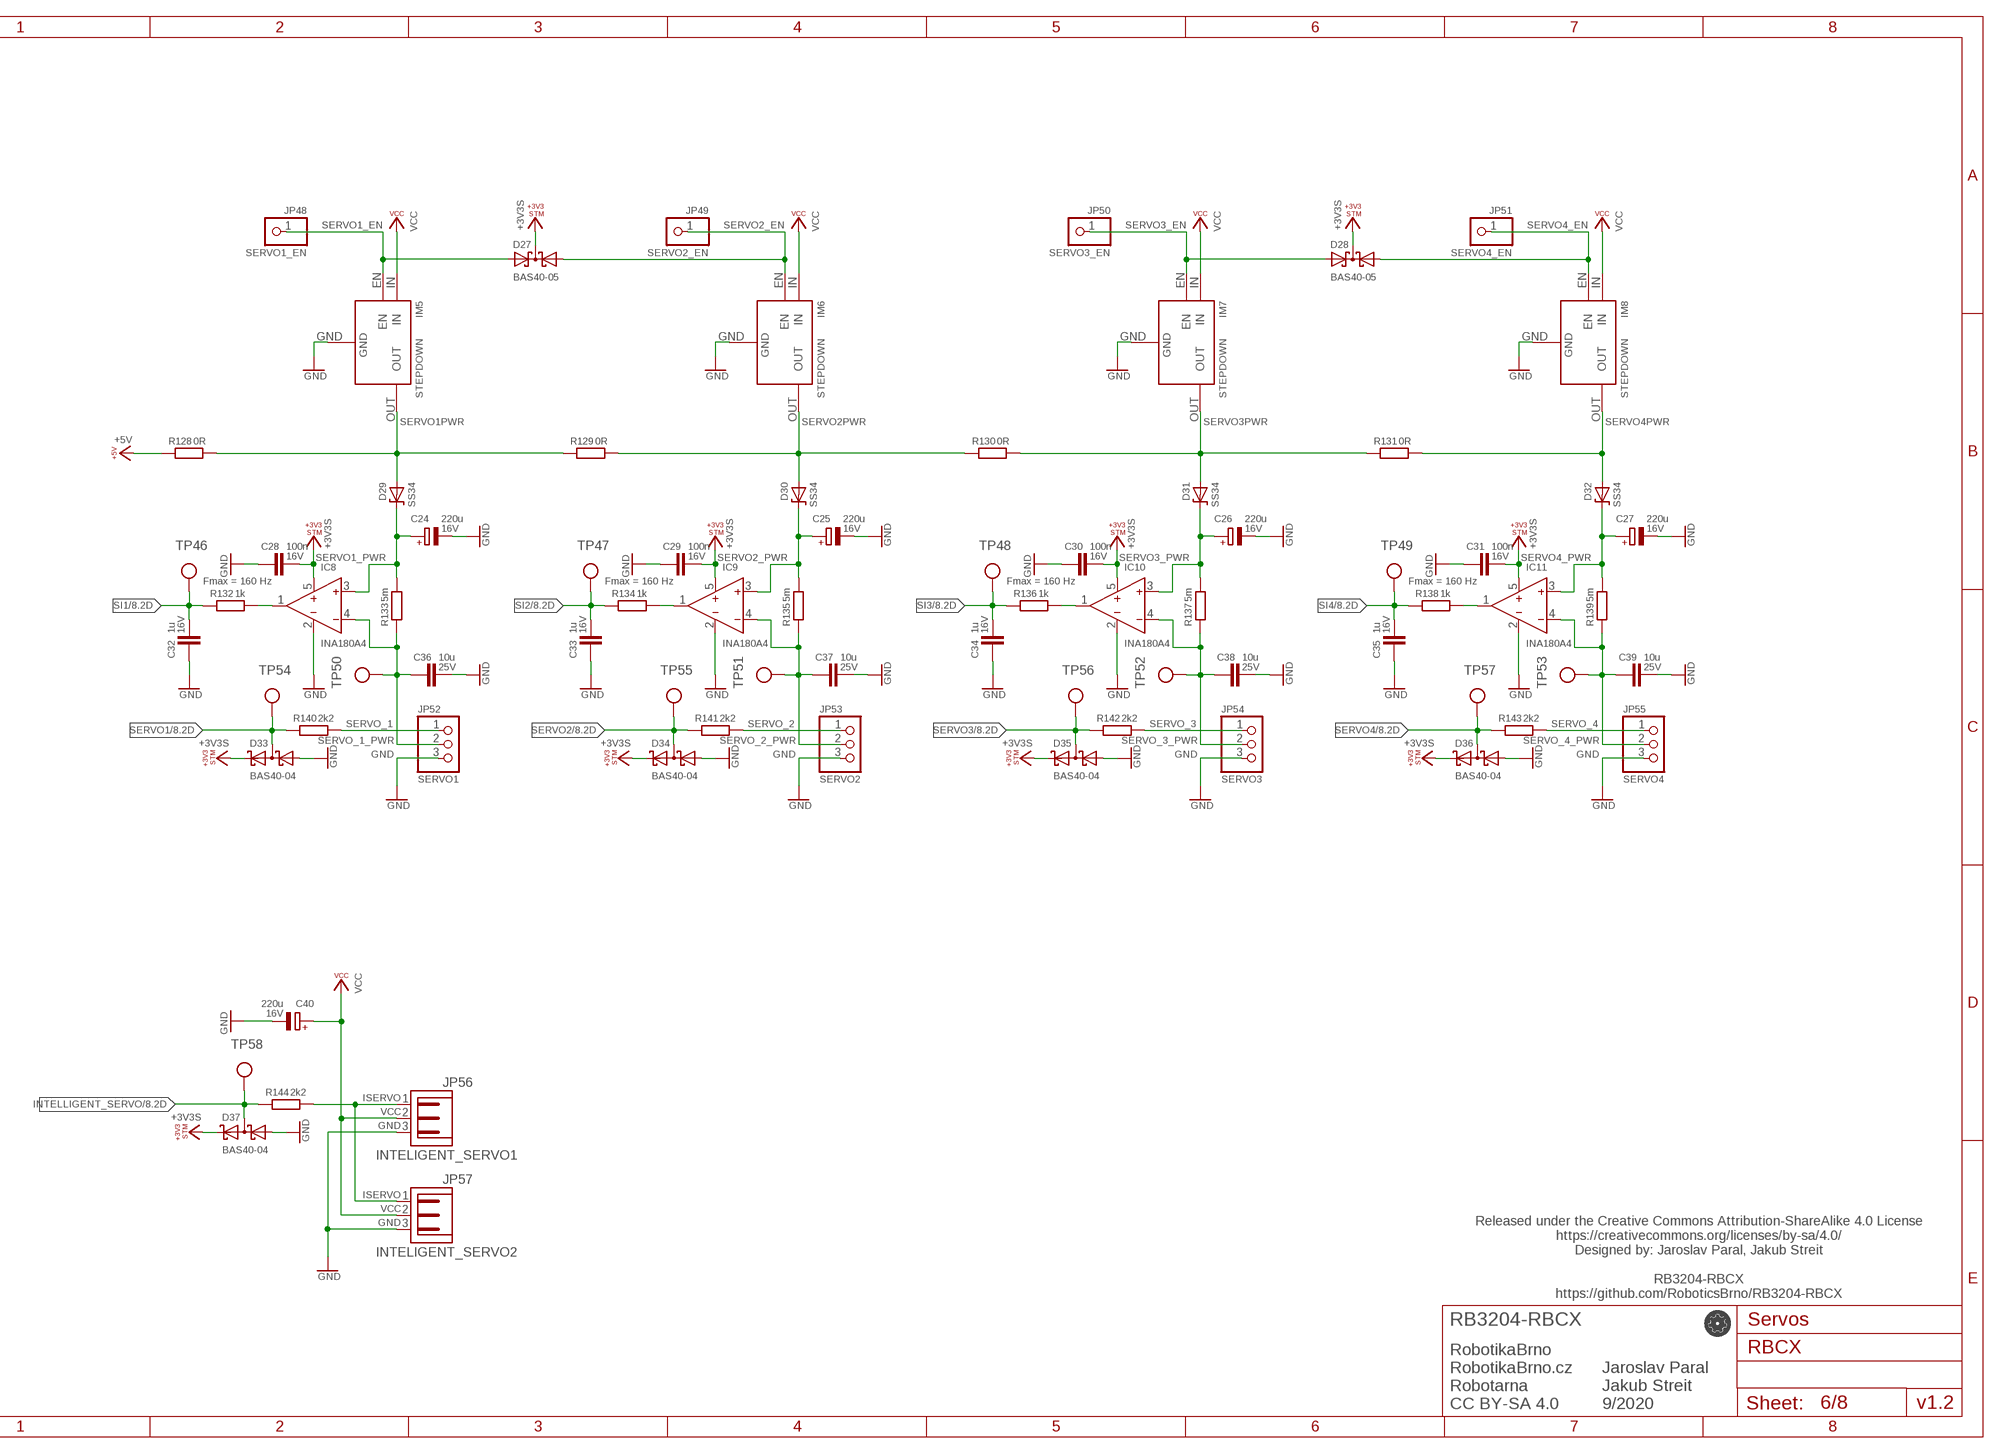
[diagram p11: schematic, sheet 6, part 2 of 2]

### Parts
C24  220u  CPOL-EUE5-10.5  [E5-10,5]  (not fitted in variant TOP_SMD_FULL)  (not fitted in variant TOP_SMD_WITHOUT_MPU)  (not fitted in variant TOP_SMD_WITHOUT_MOTOR_CURRENT)  (not fitted in variant TOP_SMD_WITHOUT_SERVO_CURRENT)  (not fitted in variant TOP_SMD_WITHOUT_CURRENT)  (not fitted in variant TOP_SMD_MINIMAL)
C25  220u  CPOL-EUE5-10.5  [E5-10,5]  (not fitted in variant TOP_SMD_FULL)  (not fitted in variant TOP_SMD_WITHOUT_MPU)  (not fitted in variant TOP_SMD_WITHOUT_MOTOR_CURRENT)  (not fitted in variant TOP_SMD_WITHOUT_SERVO_CURRENT)  (not fitted in variant TOP_SMD_WITHOUT_CURRENT)  (not fitted in variant TOP_SMD_MINIMAL)
C26  220u  CPOL-EUE5-10.5  [E5-10,5]  (not fitted in variant TOP_SMD_FULL)  (not fitted in variant TOP_SMD_WITHOUT_MPU)  (not fitted in variant TOP_SMD_WITHOUT_MOTOR_CURRENT)  (not fitted in variant TOP_SMD_WITHOUT_SERVO_CURRENT)  (not fitted in variant TOP_SMD_WITHOUT_CURRENT)  (not fitted in variant TOP_SMD_MINIMAL)
C27  220u  CPOL-EUE5-10.5  [E5-10,5]  (not fitted in variant TOP_SMD_FULL)  (not fitted in variant TOP_SMD_WITHOUT_MPU)  (not fitted in variant TOP_SMD_WITHOUT_MOTOR_CURRENT)  (not fitted in variant TOP_SMD_WITHOUT_SERVO_CURRENT)  (not fitted in variant TOP_SMD_WITHOUT_CURRENT)  (not fitted in variant TOP_SMD_MINIMAL)
C28  100n  C-EUC0402  [C0402]  (not fitted in variant TOP_SMD_WITHOUT_SERVO_CURRENT)  (not fitted in variant TOP_SMD_WITHOUT_CURRENT)  (not fitted in variant TOP_SMD_MINIMAL)
C29  100n  C-EUC0402  [C0402]  (not fitted in variant TOP_SMD_WITHOUT_SERVO_CURRENT)  (not fitted in variant TOP_SMD_WITHOUT_CURRENT)  (not fitted in variant TOP_SMD_MINIMAL)
C30  100n  C-EUC0402  [C0402]  (not fitted in variant TOP_SMD_WITHOUT_SERVO_CURRENT)  (not fitted in variant TOP_SMD_WITHOUT_CURRENT)  (not fitted in variant TOP_SMD_MINIMAL)
C31  100n  C-EUC0402  [C0402]  (not fitted in variant TOP_SMD_WITHOUT_SERVO_CURRENT)  (not fitted in variant TOP_SMD_WITHOUT_CURRENT)  (not fitted in variant TOP_SMD_MINIMAL)
C32  1u  C-EUC0402  [C0402]  (not fitted in variant TOP_SMD_WITHOUT_SERVO_CURRENT)  (not fitted in variant TOP_SMD_WITHOUT_CURRENT)  (not fitted in variant TOP_SMD_MINIMAL)
C33  1u  C-EUC0402  [C0402]  (not fitted in variant TOP_SMD_WITHOUT_SERVO_CURRENT)  (not fitted in variant TOP_SMD_WITHOUT_CURRENT)  (not fitted in variant TOP_SMD_MINIMAL)
C34  1u  C-EUC0402  [C0402]  (not fitted in variant TOP_SMD_WITHOUT_SERVO_CURRENT)  (not fitted in variant TOP_SMD_WITHOUT_CURRENT)  (not fitted in variant TOP_SMD_MINIMAL)
C35  1u  C-EUC0402  [C0402]  (not fitted in variant TOP_SMD_WITHOUT_SERVO_CURRENT)  (not fitted in variant TOP_SMD_WITHOUT_CURRENT)  (not fitted in variant TOP_SMD_MINIMAL)
C36  10u  C-EUC0805  [C0805]
C37  10u  C-EUC0805  [C0805]
C38  10u  C-EUC0805  [C0805]
C39  10u  C-EUC0805  [C0805]
C40  220u  CPOL-EUE5-10.5  [E5-10,5]  (not fitted in variant TOP_SMD_FULL)  (not fitted in variant TOP_SMD_WITHOUT_MPU)  (not fitted in variant TOP_SMD_WITHOUT_MOTOR_CURRENT)  (not fitted in variant TOP_SMD_WITHOUT_SERVO_CURRENT)  (not fitted in variant TOP_SMD_WITHOUT_CURRENT)  (not fitted in variant TOP_SMD_MINIMAL)
D27  BAS40-05  [SOT23]  (not fitted in variant TOP_SMD_MINIMAL)
D28  BAS40-05  [SOT23]  (not fitted in variant TOP_SMD_MINIMAL)
D29  SS34  SHOTTKY-SMA  [SMA]
D30  SS34  SHOTTKY-SMA  [SMA]
D31  SS34  SHOTTKY-SMA  [SMA]
D32  SS34  SHOTTKY-SMA  [SMA]
D33  BAS40-04  [SOT23]
D34  BAS40-04  [SOT23]
D35  BAS40-04  [SOT23]
D36  BAS40-04  [SOT23]
D37  BAS40-04  [SOT23]
IC8  INA180A4  INA180A  [SOT23-5L]  (not fitted in variant TOP_SMD_WITHOUT_SERVO_CURRENT)  (not fitted in variant TOP_SMD_WITHOUT_CURRENT)  (not fitted in variant TOP_SMD_MINIMAL)
IC9  INA180A4  INA180A  [SOT23-5L]  (not fitted in variant TOP_SMD_WITHOUT_SERVO_CURRENT)  (not fitted in variant TOP_SMD_WITHOUT_CURRENT)  (not fitted in variant TOP_SMD_MINIMAL)
IC10  INA180A4  INA180A  [SOT23-5L]  (not fitted in variant TOP_SMD_WITHOUT_SERVO_CURRENT)  (not fitted in variant TOP_SMD_WITHOUT_CURRENT)  (not fitted in variant TOP_SMD_MINIMAL)
IC11  INA180A4  INA180A  [SOT23-5L]  (not fitted in variant TOP_SMD_WITHOUT_SERVO_CURRENT)  (not fitted in variant TOP_SMD_WITHOUT_CURRENT)  (not fitted in variant TOP_SMD_MINIMAL)
IM5  STEPDOWN  [STEPDOWN]  (not fitted in variant TOP_SMD_FULL)  (not fitted in variant TOP_SMD_WITHOUT_MPU)  (not fitted in variant TOP_SMD_WITHOUT_MOTOR_CURRENT)  (not fitted in variant TOP_SMD_WITHOUT_SERVO_CURRENT)  (not fitted in variant TOP_SMD_WITHOUT_CURRENT)  (not fitted in variant TOP_SMD_MINIMAL)
IM6  STEPDOWN  [STEPDOWN]  (not fitted in variant TOP_SMD_FULL)  (not fitted in variant TOP_SMD_WITHOUT_MPU)  (not fitted in variant TOP_SMD_WITHOUT_MOTOR_CURRENT)  (not fitted in variant TOP_SMD_WITHOUT_SERVO_CURRENT)  (not fitted in variant TOP_SMD_WITHOUT_CURRENT)  (not fitted in variant TOP_SMD_MINIMAL)
IM7  STEPDOWN  [STEPDOWN]  (not fitted in variant TOP_SMD_FULL)  (not fitted in variant TOP_SMD_WITHOUT_MPU)  (not fitted in variant TOP_SMD_WITHOUT_MOTOR_CURRENT)  (not fitted in variant TOP_SMD_WITHOUT_SERVO_CURRENT)  (not fitted in variant TOP_SMD_WITHOUT_CURRENT)  (not fitted in variant TOP_SMD_MINIMAL)
IM8  STEPDOWN  [STEPDOWN]  (not fitted in variant TOP_SMD_FULL)  (not fitted in variant TOP_SMD_WITHOUT_MPU)  (not fitted in variant TOP_SMD_WITHOUT_MOTOR_CURRENT)  (not fitted in variant TOP_SMD_WITHOUT_SERVO_CURRENT)  (not fitted in variant TOP_SMD_WITHOUT_CURRENT)  (not fitted in variant TOP_SMD_MINIMAL)
JP48  SERVO1_EN  PINHD-1X1  [1X01]  (not fitted in variant TOP_SMD_FULL)  (not fitted in variant TOP_SMD_WITHOUT_MPU)  (not fitted in variant TOP_SMD_WITHOUT_MOTOR_CURRENT)  (not fitted in variant TOP_SMD_WITHOUT_SERVO_CURRENT)  (not fitted in variant TOP_SMD_WITHOUT_CURRENT)  (not fitted in variant TOP_SMD_MINIMAL)
JP49  SERVO2_EN  PINHD-1X1  [1X01]  (not fitted in variant TOP_SMD_FULL)  (not fitted in variant TOP_SMD_WITHOUT_MPU)  (not fitted in variant TOP_SMD_WITHOUT_MOTOR_CURRENT)  (not fitted in variant TOP_SMD_WITHOUT_SERVO_CURRENT)  (not fitted in variant TOP_SMD_WITHOUT_CURRENT)  (not fitted in variant TOP_SMD_MINIMAL)
JP50  SERVO3_EN  PINHD-1X1  [1X01]  (not fitted in variant TOP_SMD_FULL)  (not fitted in variant TOP_SMD_WITHOUT_MPU)  (not fitted in variant TOP_SMD_WITHOUT_MOTOR_CURRENT)  (not fitted in variant TOP_SMD_WITHOUT_SERVO_CURRENT)  (not fitted in variant TOP_SMD_WITHOUT_CURRENT)  (not fitted in variant TOP_SMD_MINIMAL)
JP51  SERVO4_EN  PINHD-1X1  [1X01]  (not fitted in variant TOP_SMD_FULL)  (not fitted in variant TOP_SMD_WITHOUT_MPU)  (not fitted in variant TOP_SMD_WITHOUT_MOTOR_CURRENT)  (not fitted in variant TOP_SMD_WITHOUT_SERVO_CURRENT)  (not fitted in variant TOP_SMD_WITHOUT_CURRENT)  (not fitted in variant TOP_SMD_MINIMAL)
JP52  SERVO1  PINHD-1X3  [1X03]  (not fitted in variant TOP_SMD_FULL)  (not fitted in variant TOP_SMD_WITHOUT_MPU)  (not fitted in variant TOP_SMD_WITHOUT_MOTOR_CURRENT)  (not fitted in variant TOP_SMD_WITHOUT_SERVO_CURRENT)  (not fitted in variant TOP_SMD_WITHOUT_CURRENT)  (not fitted in variant TOP_SMD_MINIMAL)
JP53  SERVO2  PINHD-1X3  [1X03]  (not fitted in variant TOP_SMD_FULL)  (not fitted in variant TOP_SMD_WITHOUT_MPU)  (not fitted in variant TOP_SMD_WITHOUT_MOTOR_CURRENT)  (not fitted in variant TOP_SMD_WITHOUT_SERVO_CURRENT)  (not fitted in variant TOP_SMD_WITHOUT_CURRENT)  (not fitted in variant TOP_SMD_MINIMAL)
JP54  SERVO3  PINHD-1X3  [1X03]  (not fitted in variant TOP_SMD_FULL)  (not fitted in variant TOP_SMD_WITHOUT_MPU)  (not fitted in variant TOP_SMD_WITHOUT_MOTOR_CURRENT)  (not fitted in variant TOP_SMD_WITHOUT_SERVO_CURRENT)  (not fitted in variant TOP_SMD_WITHOUT_CURRENT)  (not fitted in variant TOP_SMD_MINIMAL)
JP55  SERVO4  PINHD-1X3  [1X03]  (not fitted in variant TOP_SMD_FULL)  (not fitted in variant TOP_SMD_WITHOUT_MPU)  (not fitted in variant TOP_SMD_WITHOUT_MOTOR_CURRENT)  (not fitted in variant TOP_SMD_WITHOUT_SERVO_CURRENT)  (not fitted in variant TOP_SMD_WITHOUT_CURRENT)  (not fitted in variant TOP_SMD_MINIMAL)
JP56  INTELIGENT_SERVO1  JST-PH3  [JST-PH3]  (not fitted in variant TOP_SMD_FULL)  (not fitted in variant TOP_SMD_WITHOUT_MPU)  (not fitted in variant TOP_SMD_WITHOUT_MOTOR_CURRENT)  (not fitted in variant TOP_SMD_WITHOUT_SERVO_CURRENT)  (not fitted in variant TOP_SMD_WITHOUT_CURRENT)  (not fitted in variant TOP_SMD_MINIMAL)
JP57  INTELIGENT_SERVO2  JST-PH3  [JST-PH3]  (not fitted in variant TOP_SMD_FULL)  (not fitted in variant TOP_SMD_WITHOUT_MPU)  (not fitted in variant TOP_SMD_WITHOUT_MOTOR_CURRENT)  (not fitted in variant TOP_SMD_WITHOUT_SERVO_CURRENT)  (not fitted in variant TOP_SMD_WITHOUT_CURRENT)  (not fitted in variant TOP_SMD_MINIMAL)
R128  0R  R-EU_R1206  [R1206]
R129  0R  R-EU_R1206  [R1206]
R130  0R  R-EU_R1206  [R1206]
R131  0R  R-EU_R1206  [R1206]
R132  1k  R-EU_R0402  [R0402]  (not fitted in variant TOP_SMD_WITHOUT_SERVO_CURRENT)  (not fitted in variant TOP_SMD_WITHOUT_CURRENT)  (not fitted in variant TOP_SMD_MINIMAL)
R133  5m  R-EU_R1206  [R1206]  (variant TOP_SMD_WITHOUT_SERVO_CURRENT: 0R)  (variant TOP_SMD_WITHOUT_CURRENT: 0R)  (variant TOP_SMD_MINIMAL: 0R)
R134  1k  R-EU_R0402  [R0402]  (not fitted in variant TOP_SMD_WITHOUT_SERVO_CURRENT)  (not fitted in variant TOP_SMD_WITHOUT_CURRENT)  (not fitted in variant TOP_SMD_MINIMAL)
R135  5m  R-EU_R1206  [R1206]  (variant TOP_SMD_WITHOUT_SERVO_CURRENT: 0R)  (variant TOP_SMD_WITHOUT_CURRENT: 0R)  (variant TOP_SMD_MINIMAL: 0R)
R136  1k  R-EU_R0402  [R0402]  (not fitted in variant TOP_SMD_WITHOUT_SERVO_CURRENT)  (not fitted in variant TOP_SMD_WITHOUT_CURRENT)  (not fitted in variant TOP_SMD_MINIMAL)
R137  5m  R-EU_R1206  [R1206]  (variant TOP_SMD_WITHOUT_SERVO_CURRENT: 0R)  (variant TOP_SMD_WITHOUT_CURRENT: 0R)  (variant TOP_SMD_MINIMAL: 0R)
R138  1k  R-EU_R0402  [R0402]  (not fitted in variant TOP_SMD_WITHOUT_SERVO_CURRENT)  (not fitted in variant TOP_SMD_WITHOUT_CURRENT)  (not fitted in variant TOP_SMD_MINIMAL)
R139  5m  R-EU_R1206  [R1206]  (variant TOP_SMD_WITHOUT_SERVO_CURRENT: 0R)  (variant TOP_SMD_WITHOUT_CURRENT: 0R)  (variant TOP_SMD_MINIMAL: 0R)
R140  2k2  R-EU_R0402  [R0402]
R141  2k2  R-EU_R0402  [R0402]
R142  2k2  R-EU_R0402  [R0402]
R143  2k2  R-EU_R0402  [R0402]
R144  2k2  R-EU_R0402  [R0402]
TP46  TP_06MM  [TP_06]  (not fitted in variant TOP_SMD_FULL)  (not fitted in variant TOP_SMD_WITHOUT_MPU)  (not fitted in variant TOP_SMD_WITHOUT_MOTOR_CURRENT)  (not fitted in variant TOP_SMD_WITHOUT_SERVO_CURRENT)  (not fitted in variant TOP_SMD_WITHOUT_CURRENT)  (not fitted in variant TOP_SMD_MINIMAL)
TP47  TP_06MM  [TP_06]  (not fitted in variant TOP_SMD_FULL)  (not fitted in variant TOP_SMD_WITHOUT_MPU)  (not fitted in variant TOP_SMD_WITHOUT_MOTOR_CURRENT)  (not fitted in variant TOP_SMD_WITHOUT_SERVO_CURRENT)  (not fitted in variant TOP_SMD_WITHOUT_CURRENT)  (not fitted in variant TOP_SMD_MINIMAL)
TP48  TP_06MM  [TP_06]  (not fitted in variant TOP_SMD_FULL)  (not fitted in variant TOP_SMD_WITHOUT_MPU)  (not fitted in variant TOP_SMD_WITHOUT_MOTOR_CURRENT)  (not fitted in variant TOP_SMD_WITHOUT_SERVO_CURRENT)  (not fitted in variant TOP_SMD_WITHOUT_CURRENT)  (not fitted in variant TOP_SMD_MINIMAL)
TP49  TP_06MM  [TP_06]  (not fitted in variant TOP_SMD_FULL)  (not fitted in variant TOP_SMD_WITHOUT_MPU)  (not fitted in variant TOP_SMD_WITHOUT_MOTOR_CURRENT)  (not fitted in variant TOP_SMD_WITHOUT_SERVO_CURRENT)  (not fitted in variant TOP_SMD_WITHOUT_CURRENT)  (not fitted in variant TOP_SMD_MINIMAL)
TP50  TP_06MM  [TP_06]  (not fitted in variant TOP_SMD_FULL)  (not fitted in variant TOP_SMD_WITHOUT_MPU)  (not fitted in variant TOP_SMD_WITHOUT_MOTOR_CURRENT)  (not fitted in variant TOP_SMD_WITHOUT_SERVO_CURRENT)  (not fitted in variant TOP_SMD_WITHOUT_CURRENT)  (not fitted in variant TOP_SMD_MINIMAL)
TP51  TP_06MM  [TP_06]  (not fitted in variant TOP_SMD_FULL)  (not fitted in variant TOP_SMD_WITHOUT_MPU)  (not fitted in variant TOP_SMD_WITHOUT_MOTOR_CURRENT)  (not fitted in variant TOP_SMD_WITHOUT_SERVO_CURRENT)  (not fitted in variant TOP_SMD_WITHOUT_CURRENT)  (not fitted in variant TOP_SMD_MINIMAL)
TP52  TP_06MM  [TP_06]  (not fitted in variant TOP_SMD_FULL)  (not fitted in variant TOP_SMD_WITHOUT_MPU)  (not fitted in variant TOP_SMD_WITHOUT_MOTOR_CURRENT)  (not fitted in variant TOP_SMD_WITHOUT_SERVO_CURRENT)  (not fitted in variant TOP_SMD_WITHOUT_CURRENT)  (not fitted in variant TOP_SMD_MINIMAL)
TP53  TP_06MM  [TP_06]  (not fitted in variant TOP_SMD_FULL)  (not fitted in variant TOP_SMD_WITHOUT_MPU)  (not fitted in variant TOP_SMD_WITHOUT_MOTOR_CURRENT)  (not fitted in variant TOP_SMD_WITHOUT_SERVO_CURRENT)  (not fitted in variant TOP_SMD_WITHOUT_CURRENT)  (not fitted in variant TOP_SMD_MINIMAL)
TP54  TP_06MM  [TP_06]  (not fitted in variant TOP_SMD_FULL)  (not fitted in variant TOP_SMD_WITHOUT_MPU)  (not fitted in variant TOP_SMD_WITHOUT_MOTOR_CURRENT)  (not fitted in variant TOP_SMD_WITHOUT_SERVO_CURRENT)  (not fitted in variant TOP_SMD_WITHOUT_CURRENT)  (not fitted in variant TOP_SMD_MINIMAL)
TP55  TP_06MM  [TP_06]  (not fitted in variant TOP_SMD_FULL)  (not fitted in variant TOP_SMD_WITHOUT_MPU)  (not fitted in variant TOP_SMD_WITHOUT_MOTOR_CURRENT)  (not fitted in variant TOP_SMD_WITHOUT_SERVO_CURRENT)  (not fitted in variant TOP_SMD_WITHOUT_CURRENT)  (not fitted in variant TOP_SMD_MINIMAL)
TP56  TP_06MM  [TP_06]  (not fitted in variant TOP_SMD_FULL)  (not fitted in variant TOP_SMD_WITHOUT_MPU)  (not fitted in variant TOP_SMD_WITHOUT_MOTOR_CURRENT)  (not fitted in variant TOP_SMD_WITHOUT_SERVO_CURRENT)  (not fitted in variant TOP_SMD_WITHOUT_CURRENT)  (not fitted in variant TOP_SMD_MINIMAL)
TP57  TP_06MM  [TP_06]  (not fitted in variant TOP_SMD_FULL)  (not fitted in variant TOP_SMD_WITHOUT_MPU)  (not fitted in variant TOP_SMD_WITHOUT_MOTOR_CURRENT)  (not fitted in variant TOP_SMD_WITHOUT_SERVO_CURRENT)  (not fitted in variant TOP_SMD_WITHOUT_CURRENT)  (not fitted in variant TOP_SMD_MINIMAL)
TP58  TP_06MM  [TP_06]  (not fitted in variant TOP_SMD_FULL)  (not fitted in variant TOP_SMD_WITHOUT_MPU)  (not fitted in variant TOP_SMD_WITHOUT_MOTOR_CURRENT)  (not fitted in variant TOP_SMD_WITHOUT_SERVO_CURRENT)  (not fitted in variant TOP_SMD_WITHOUT_CURRENT)  (not fitted in variant TOP_SMD_MINIMAL)

### Nets
+3V3S: C28.1 C29.1 C30.1 C31.1 D27.3(C) D28.3(C) D33.2(C2) D34.2(C2) D35.2(C2) D36.2(C2) D37.2(C2) IC8.5(VCC) IC9.5(VCC) IC10.5(VCC) IC11.5(VCC) ; also sheet 1,2,3,4,5,8
+5V: R128.1 ; also sheet 1,2,3,4,5,7
GND: C24.- C25.- C26.- C27.- C28.2 C29.2 C30.2 C31.2 C32.2 C33.2 C34.2 C35.2 C36.1 C37.1 C38.1 C39.1 C40.- D33.1(A1) D34.1(A1) D35.1(A1) D36.1(A1) D37.1(A1) IC8.2(GND) IC9.2(GND) IC10.2(GND) IC11.2(GND) IM5.GND IM6.GND IM7.GND IM8.GND JP52.3 JP53.3 JP54.3 JP55.3 JP56.3 JP57.3 ; also sheet 1,2,3,4,5,7,8
INTELLIGENT_SERVO: D37.3(C1A2) R144.1 TP58.P$1(TP) ; also sheet 8
ISERVO: JP56.1 JP57.1 R144.2
SERVO1: D33.3(C1A2) R140.1 TP54.P$1(TP) ; also sheet 8
SERVO1_EN: D27.2(A2) IM5.EN JP48.1
SERVO1_PWR: C24.+ D29.C IC8.3(IN+) R133.2
SERVO1PWR: D29.A IM5.OUT R128.2 R129.1
SERVO2: D34.3(C1A2) R141.1 TP55.P$1(TP) ; also sheet 8
SERVO2_EN: D27.1(A1) IM6.EN JP49.1
SERVO2_PWR: C25.+ D30.C IC9.3(IN+) R135.2
SERVO2PWR: D30.A IM6.OUT R129.2 R130.1
SERVO3: D35.3(C1A2) R142.1 TP56.P$1(TP) ; also sheet 8
SERVO3_EN: D28.2(A2) IM7.EN JP50.1
SERVO3_PWR: C26.+ D31.C IC10.3(IN+) R137.2
SERVO3PWR: D31.A IM7.OUT R130.2 R131.1
SERVO4: D36.3(C1A2) R143.1 TP57.P$1(TP) ; also sheet 8
SERVO4_EN: D28.1(A1) IM8.EN JP51.1
SERVO4_PWR: C27.+ D32.C IC11.3(IN+) R139.2
SERVO4PWR: D32.A IM8.OUT R131.2
SERVO_1: JP52.1 R140.2
SERVO_1_PWR: C36.2 IC8.4(IN-) JP52.2 R133.1 TP50.P$1(TP)
SERVO_2: JP53.1 R141.2
SERVO_2_PWR: C37.2 IC9.4(IN-) JP53.2 R135.1 TP51.P$1(TP)
SERVO_3: JP54.1 R142.2
SERVO_3_PWR: C38.2 IC10.4(IN-) JP54.2 R137.1 TP52.P$1(TP)
SERVO_4: JP55.1 R143.2
SERVO_4_PWR: C39.2 IC11.4(IN-) JP55.2 R139.1 TP53.P$1(TP)
SI1: C32.1 R132.1 TP46.P$1(TP) ; also sheet 8
SI2: C33.1 R134.1 TP47.P$1(TP) ; also sheet 8
SI3: C34.1 R136.1 TP48.P$1(TP) ; also sheet 8
SI4: C35.1 R138.1 TP49.P$1(TP) ; also sheet 8
SI_1: IC8.1(OUT) R132.2
SI_2: IC9.1(OUT) R134.2
SI_3: IC10.1(OUT) R136.2
SI_4: IC11.1(OUT) R138.2
VCC: C40.+ IM5.IN IM6.IN IM7.IN IM8.IN JP56.2 JP57.2 ; also sheet 1,2,3,4,5

### Notes on the sheet
- Fmax = 160 Hz | Fmax = 160 Hz | Fmax = 160 Hz | Fmax = 160 Hz
- Released under the Creative Commons Attribution-ShareAlike 4.0 License
  https://creativecommons.org/licenses/by-sa/4.0/
  Designed by: Jaroslav Paral, Jakub Streit
  
  RB3204-RBCX
  https://github.com/RoboticsBrno/RB3204-RBCX
- RB3204-RBCX
- RobotikaBrno
  RobotikaBrno.cz
  Robotarna
  CC BY-SA 4.0
- Jaroslav Paral
  Jakub Streit
  9/2020
- v1.2

## Sheet 7 of 8: ESP
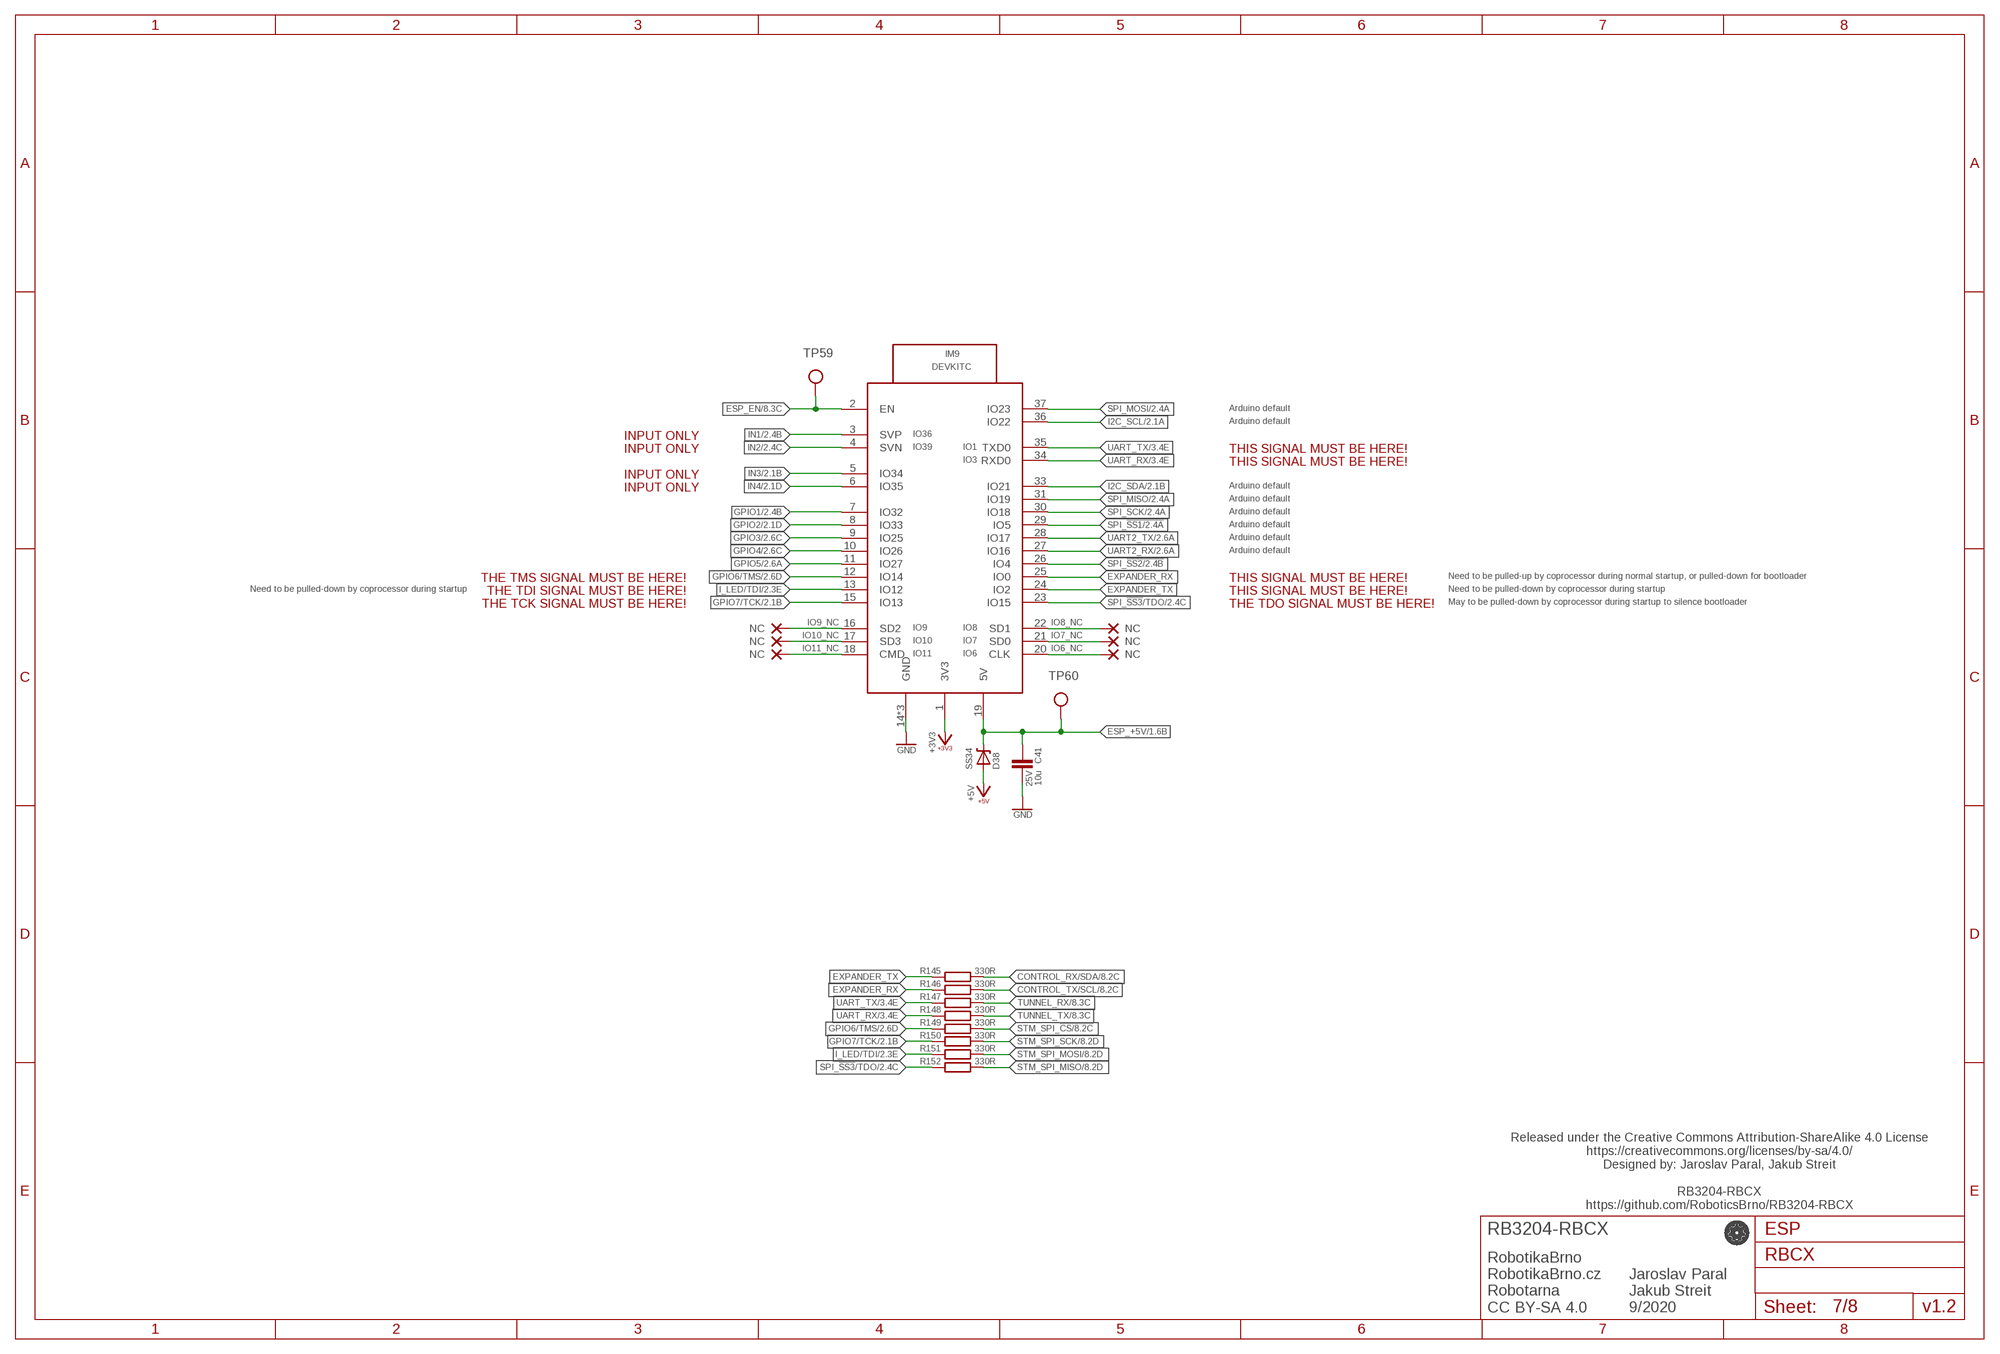
[diagram p12: schematic, sheet 7]

### Parts
C41  10u  C-EUC0805  [C0805]
D38  SS34  SHOTTKY-SMA  [SMA]
IM9  DEVKITC  [DEVKITC]  (not fitted in variant TOP_SMD_FULL)  (not fitted in variant TOP_SMD_WITHOUT_MPU)  (not fitted in variant TOP_SMD_WITHOUT_MOTOR_CURRENT)  (not fitted in variant TOP_SMD_WITHOUT_SERVO_CURRENT)  (not fitted in variant TOP_SMD_WITHOUT_CURRENT)  (not fitted in variant TOP_SMD_MINIMAL)
NC1  NC  (no package)
NC2  NC  (no package)
NC3  NC  (no package)
NC4  NC  (no package)
NC5  NC  (no package)
NC6  NC  (no package)
R145  330R  R-EU_R0402  [R0402]
R146  330R  R-EU_R0402  [R0402]
R147  330R  R-EU_R0402  [R0402]
R148  330R  R-EU_R0402  [R0402]
R149  330R  R-EU_R0402  [R0402]
R150  330R  R-EU_R0402  [R0402]
R151  330R  R-EU_R0402  [R0402]
R152  330R  R-EU_R0402  [R0402]
TP59  TP_06MM  [TP_06]  (not fitted in variant TOP_SMD_FULL)  (not fitted in variant TOP_SMD_WITHOUT_MPU)  (not fitted in variant TOP_SMD_WITHOUT_MOTOR_CURRENT)  (not fitted in variant TOP_SMD_WITHOUT_SERVO_CURRENT)  (not fitted in variant TOP_SMD_WITHOUT_CURRENT)  (not fitted in variant TOP_SMD_MINIMAL)
TP60  TP_06MM  [TP_06]  (not fitted in variant TOP_SMD_FULL)  (not fitted in variant TOP_SMD_WITHOUT_MPU)  (not fitted in variant TOP_SMD_WITHOUT_MOTOR_CURRENT)  (not fitted in variant TOP_SMD_WITHOUT_SERVO_CURRENT)  (not fitted in variant TOP_SMD_WITHOUT_CURRENT)  (not fitted in variant TOP_SMD_MINIMAL)

### Nets
+3V3: IM9.1(3V3) ; also sheet 1,2,3
+5V: D38.A ; also sheet 1,2,3,4,5,6
CONTROL_RX/SDA: R145.2 ; also sheet 3,8
CONTROL_TX/SCL: R146.2 ; also sheet 3,8
ESP_+5V: C41.2 D38.C IM9.19(5V) TP60.P$1(TP) ; also sheet 1
ESP_EN: IM9.2(EN) TP59.P$1(TP) ; also sheet 2,3,4,8
EXPANDER_RX: IM9.25(IO0) R146.1
EXPANDER_TX: IM9.24(IO2) R145.1
GND: C41.1 IM9.14(GND) IM9.32(GND) IM9.38(GND) ; also sheet 1,2,3,4,5,6,8
GPIO1: IM9.7(IO32) ; also sheet 2
GPIO2: IM9.8(IO33) ; also sheet 2
GPIO3: IM9.9(IO25) ; also sheet 2
GPIO4: IM9.10(IO26) ; also sheet 2
GPIO5: IM9.11(IO27) ; also sheet 2
GPIO6/TMS: IM9.12(IO14) R149.1 ; also sheet 2,3
GPIO7/TCK: IM9.15(IO13) R150.1 ; also sheet 2,3
I2C_SCL: IM9.36(IO22) ; also sheet 2
I2C_SDA: IM9.33(IO21) ; also sheet 2
I_LED/TDI: IM9.13(IO12) R151.1 ; also sheet 2,3
IN1: IM9.3(SVP) ; also sheet 2
IN2: IM9.4(SVN) ; also sheet 2
IN3: IM9.5(IO34) ; also sheet 2
IN4: IM9.6(IO35) ; also sheet 2
IO6_NC: IM9.20(CLK) NC4.NC
IO7_NC: IM9.21(SD0) NC5.NC
IO8_NC: IM9.22(SD1) NC6.NC
IO9_NC: IM9.16(SD2) NC1.NC
IO10_NC: IM9.17(SD3) NC2.NC
IO11_NC: IM9.18(CMD) NC3.NC
SPI_!SS1: IM9.29(IO5) ; also sheet 2
SPI_!SS2: IM9.26(IO4) ; also sheet 2
SPI_!SS3!/TDO: IM9.23(IO15) R152.1 ; also sheet 2,3
SPI_MISO: IM9.31(IO19) ; also sheet 2
SPI_MOSI: IM9.37(IO23) ; also sheet 2
SPI_SCK: IM9.30(IO18) ; also sheet 2
STM_SPI_!CS: R149.2 ; also sheet 3,8
STM_SPI_MISO: R152.2 ; also sheet 3,8
STM_SPI_MOSI: R151.2 ; also sheet 8
STM_SPI_SCK: R150.2 ; also sheet 8
TUNNEL_RX: R147.2 ; also sheet 8
TUNNEL_TX: R148.2 ; also sheet 8
UART2_RX: IM9.27(IO16) ; also sheet 2
UART2_TX: IM9.28(IO17) ; also sheet 2
UART_RX: IM9.34(RXD0) R148.1 ; also sheet 3
UART_TX: IM9.35(TXD0) R147.1 ; also sheet 3

### Notes on the sheet
- Arduino default
- Arduino default
- INPUT ONLY
- INPUT ONLY | THIS SIGNAL MUST BE HERE!
- THIS SIGNAL MUST BE HERE!
- INPUT ONLY
- INPUT ONLY | Arduino default
- Arduino default
- Arduino default
- Arduino default
- Arduino default
- Arduino default
- THE TMS SIGNAL MUST BE HERE! | THIS SIGNAL MUST BE HERE! | Need to be pulled-up by coprocessor during normal startup, or pulled-down for bootloader
- Need to be pulled-down by coprocessor during startup | THE TDI SIGNAL MUST BE HERE! | THIS SIGNAL MUST BE HERE! | Need to be pulled-down by coprocessor during startup
- THE TCK SIGNAL MUST BE HERE! | THE TDO SIGNAL MUST BE HERE! | May to be pulled-down by coprocessor during startup to silence bootloader
- Released under the Creative Commons Attribution-ShareAlike 4.0 License
  https://creativecommons.org/licenses/by-sa/4.0/
  Designed by: Jaroslav Paral, Jakub Streit
  
  RB3204-RBCX
  https://github.com/RoboticsBrno/RB3204-RBCX
- RB3204-RBCX
- RobotikaBrno
  RobotikaBrno.cz
  Robotarna
  CC BY-SA 4.0
- Jaroslav Paral
  Jakub Streit
  9/2020
- v1.2